# EAGLE design 0529_Agent_KitRev0103 (EAGLE 9.6.2)
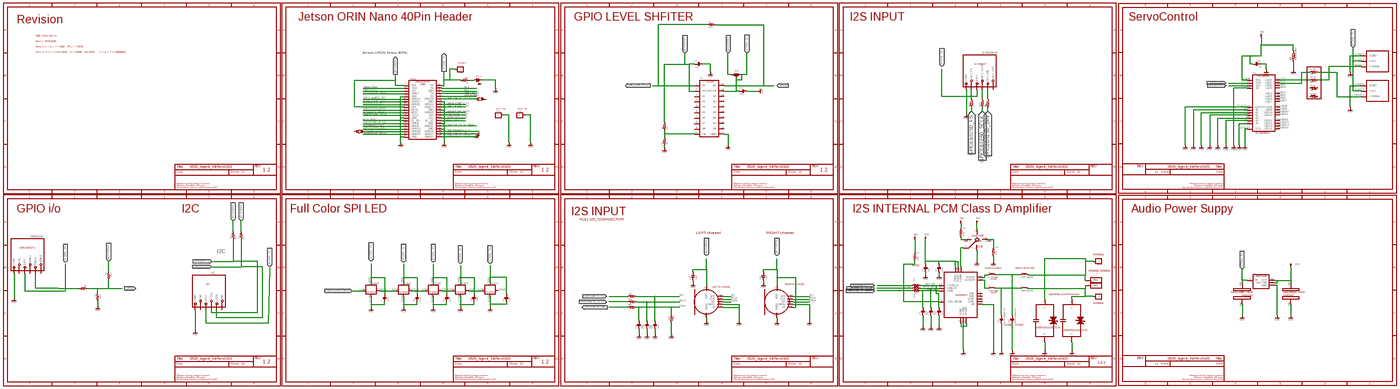
[diagram p0: schematic, sheet 1, overview]
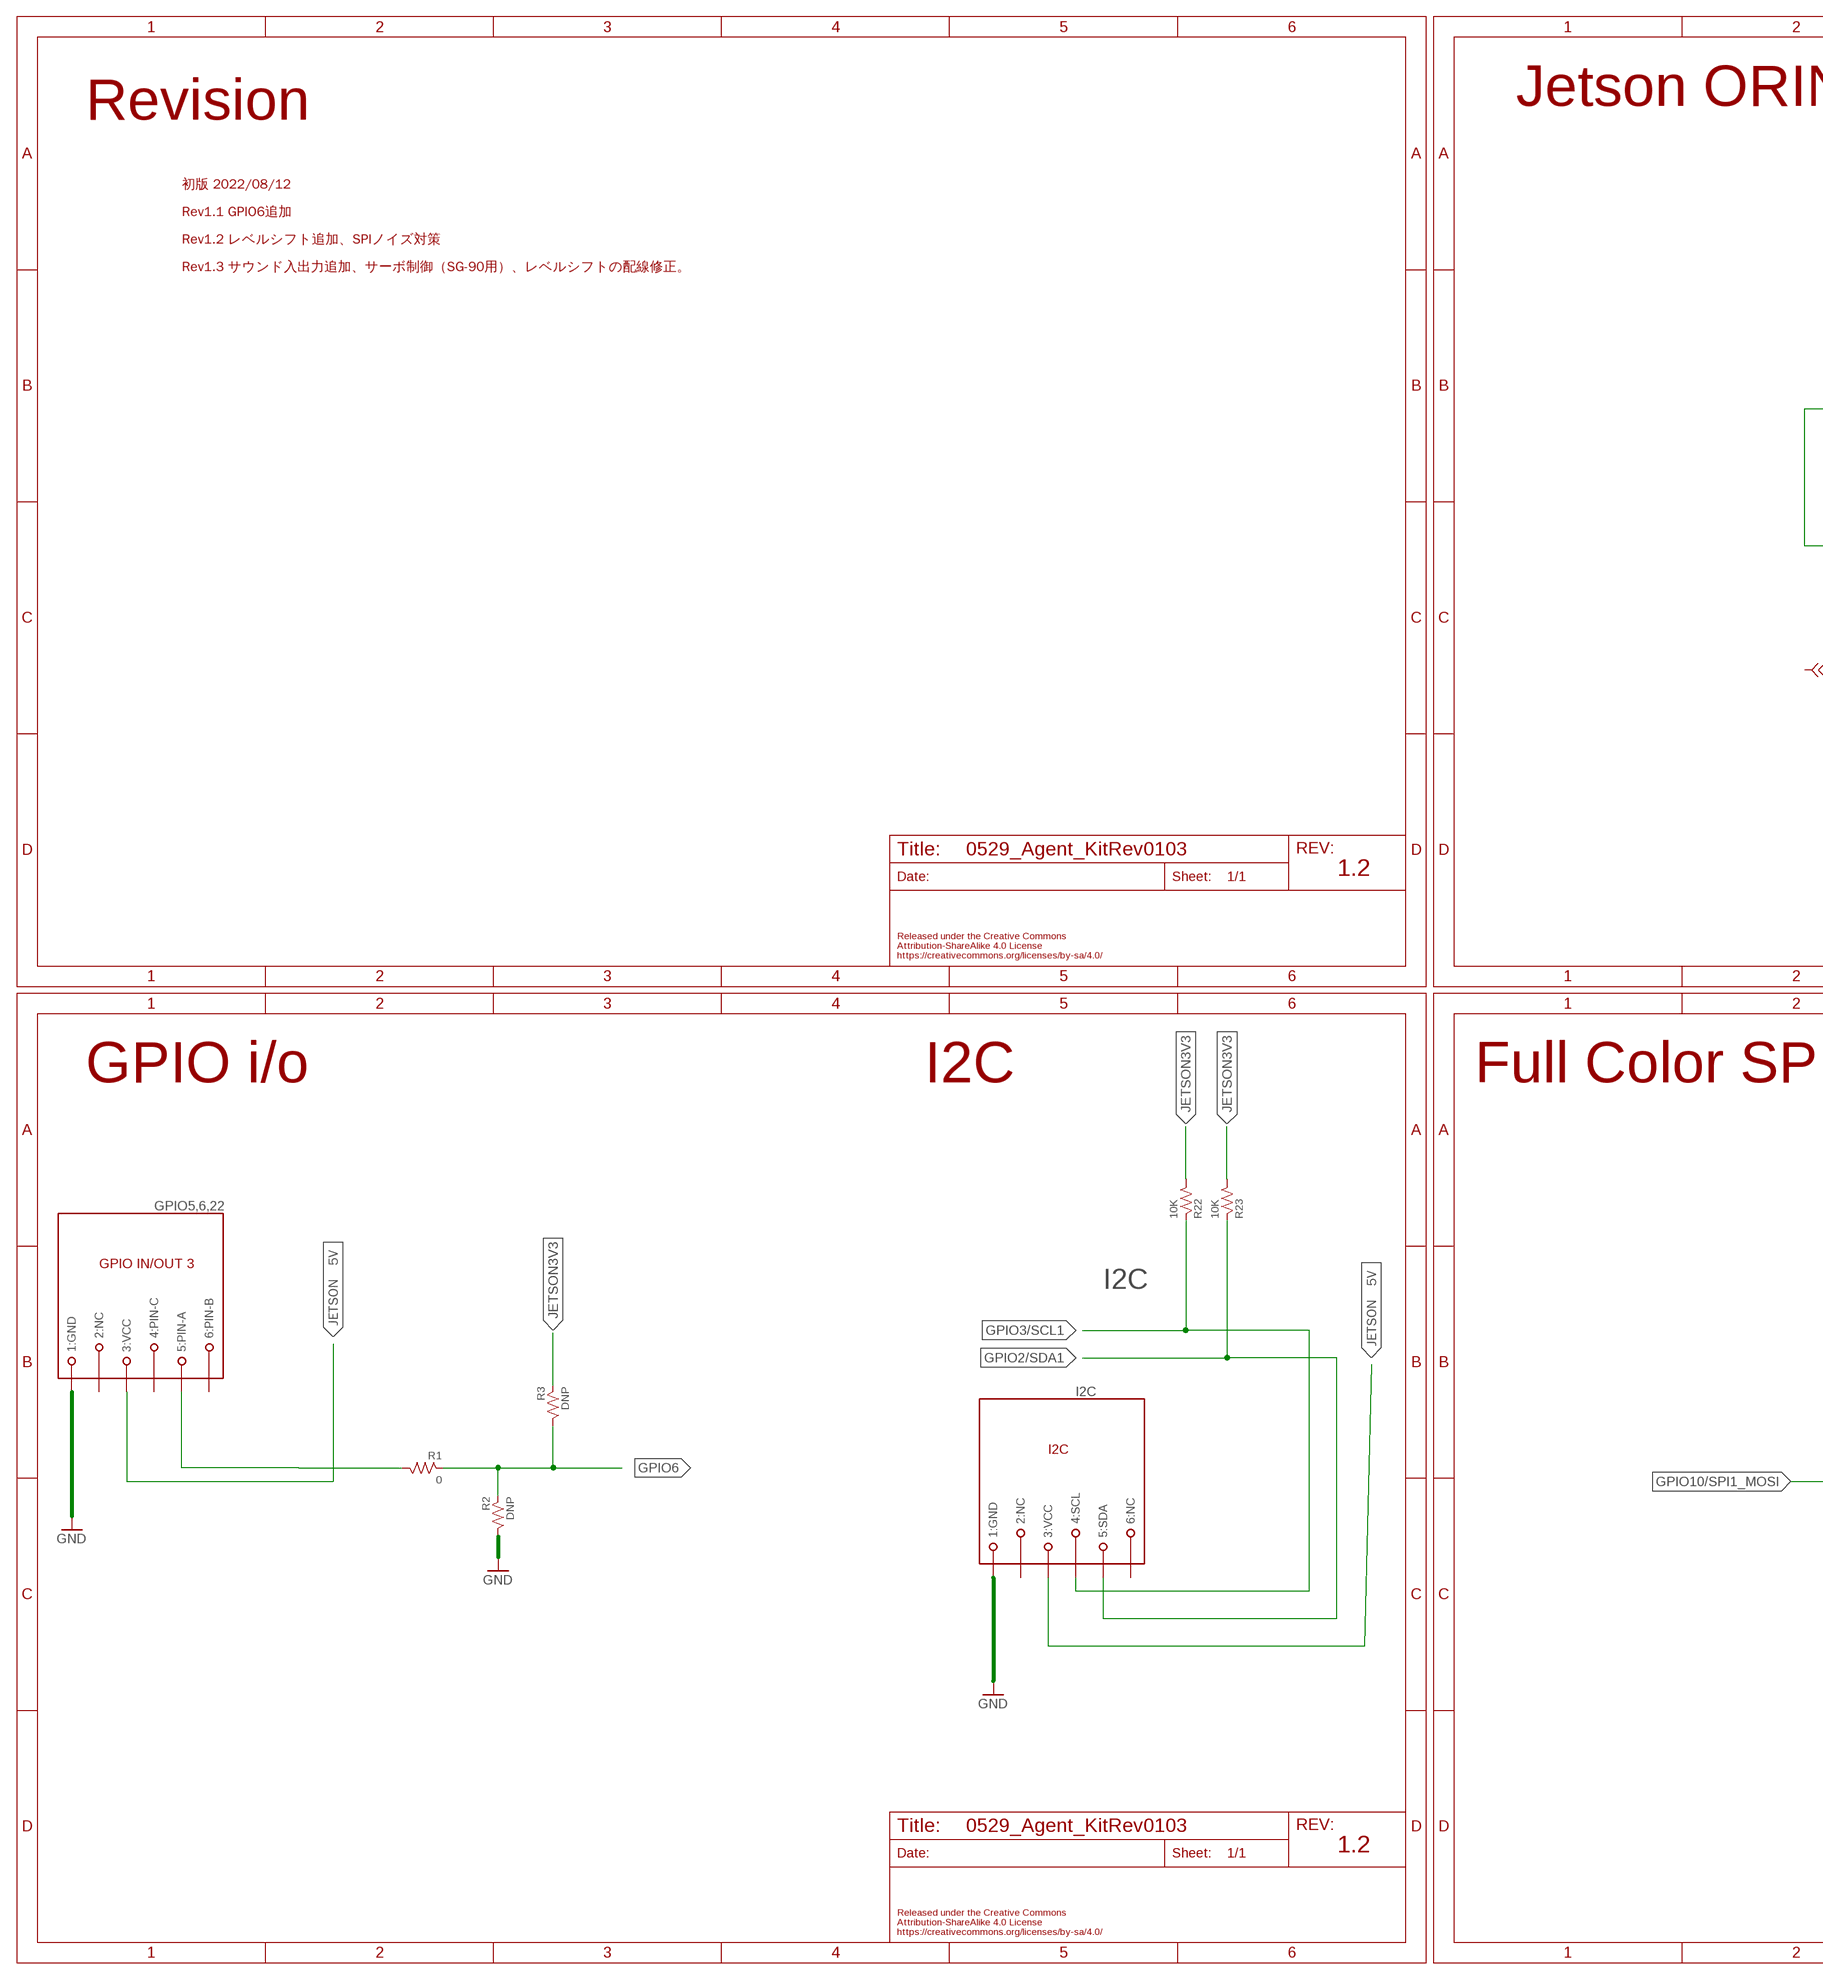
[diagram p1: schematic, sheet 1, part 1 of 4]
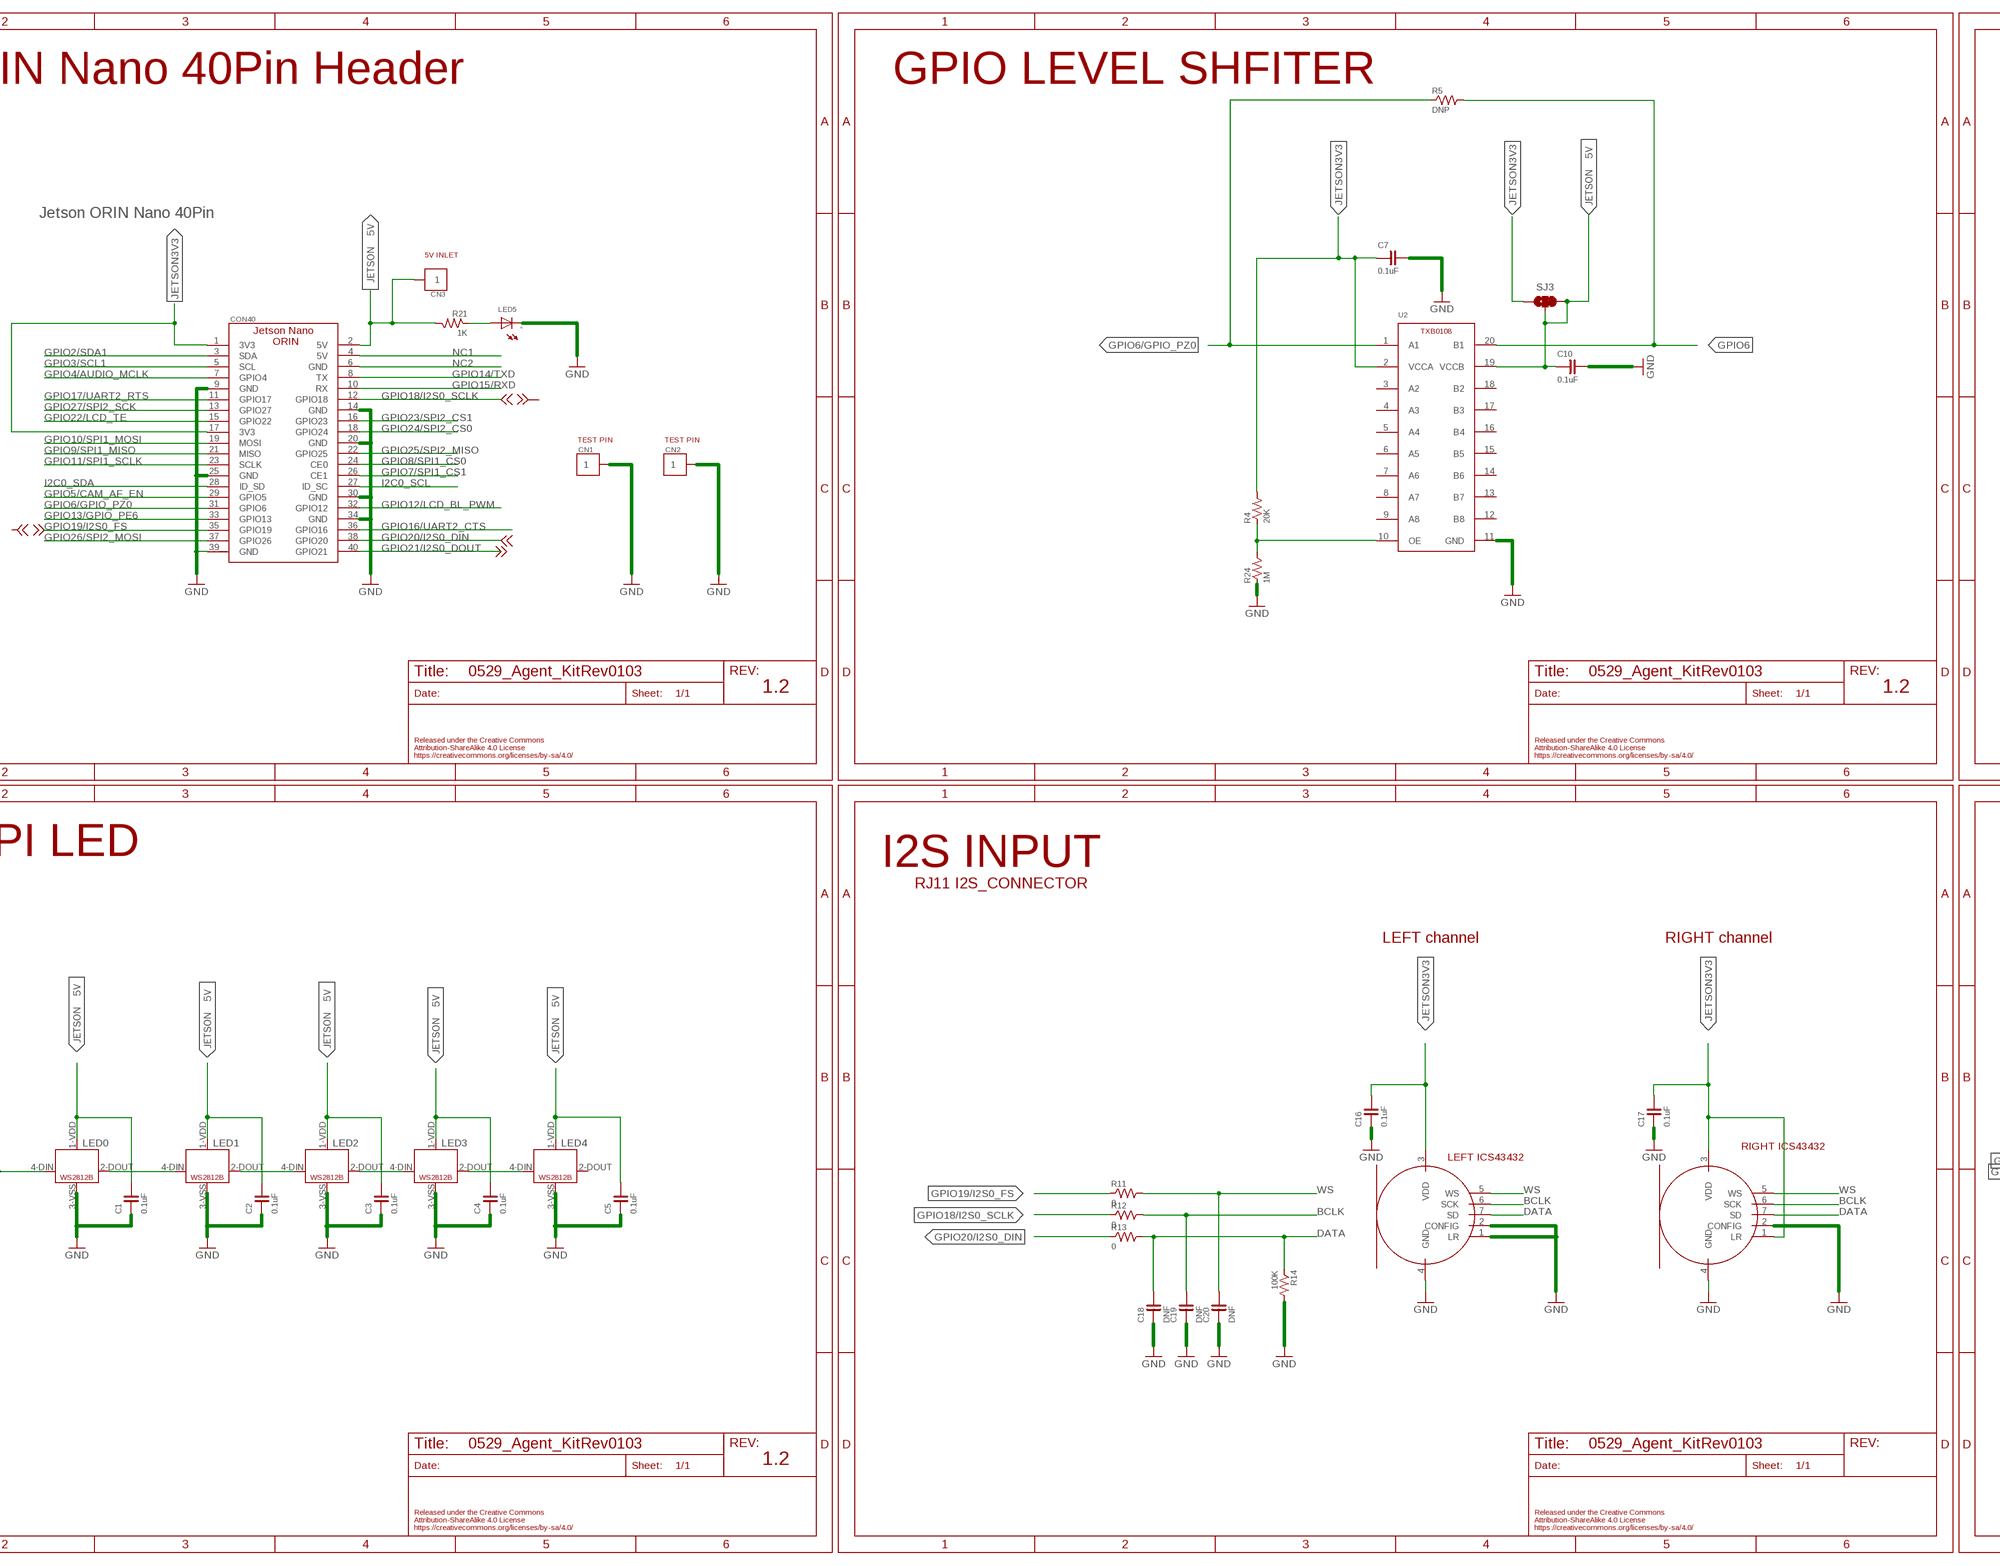
[diagram p2: schematic, sheet 1, part 2 of 4]
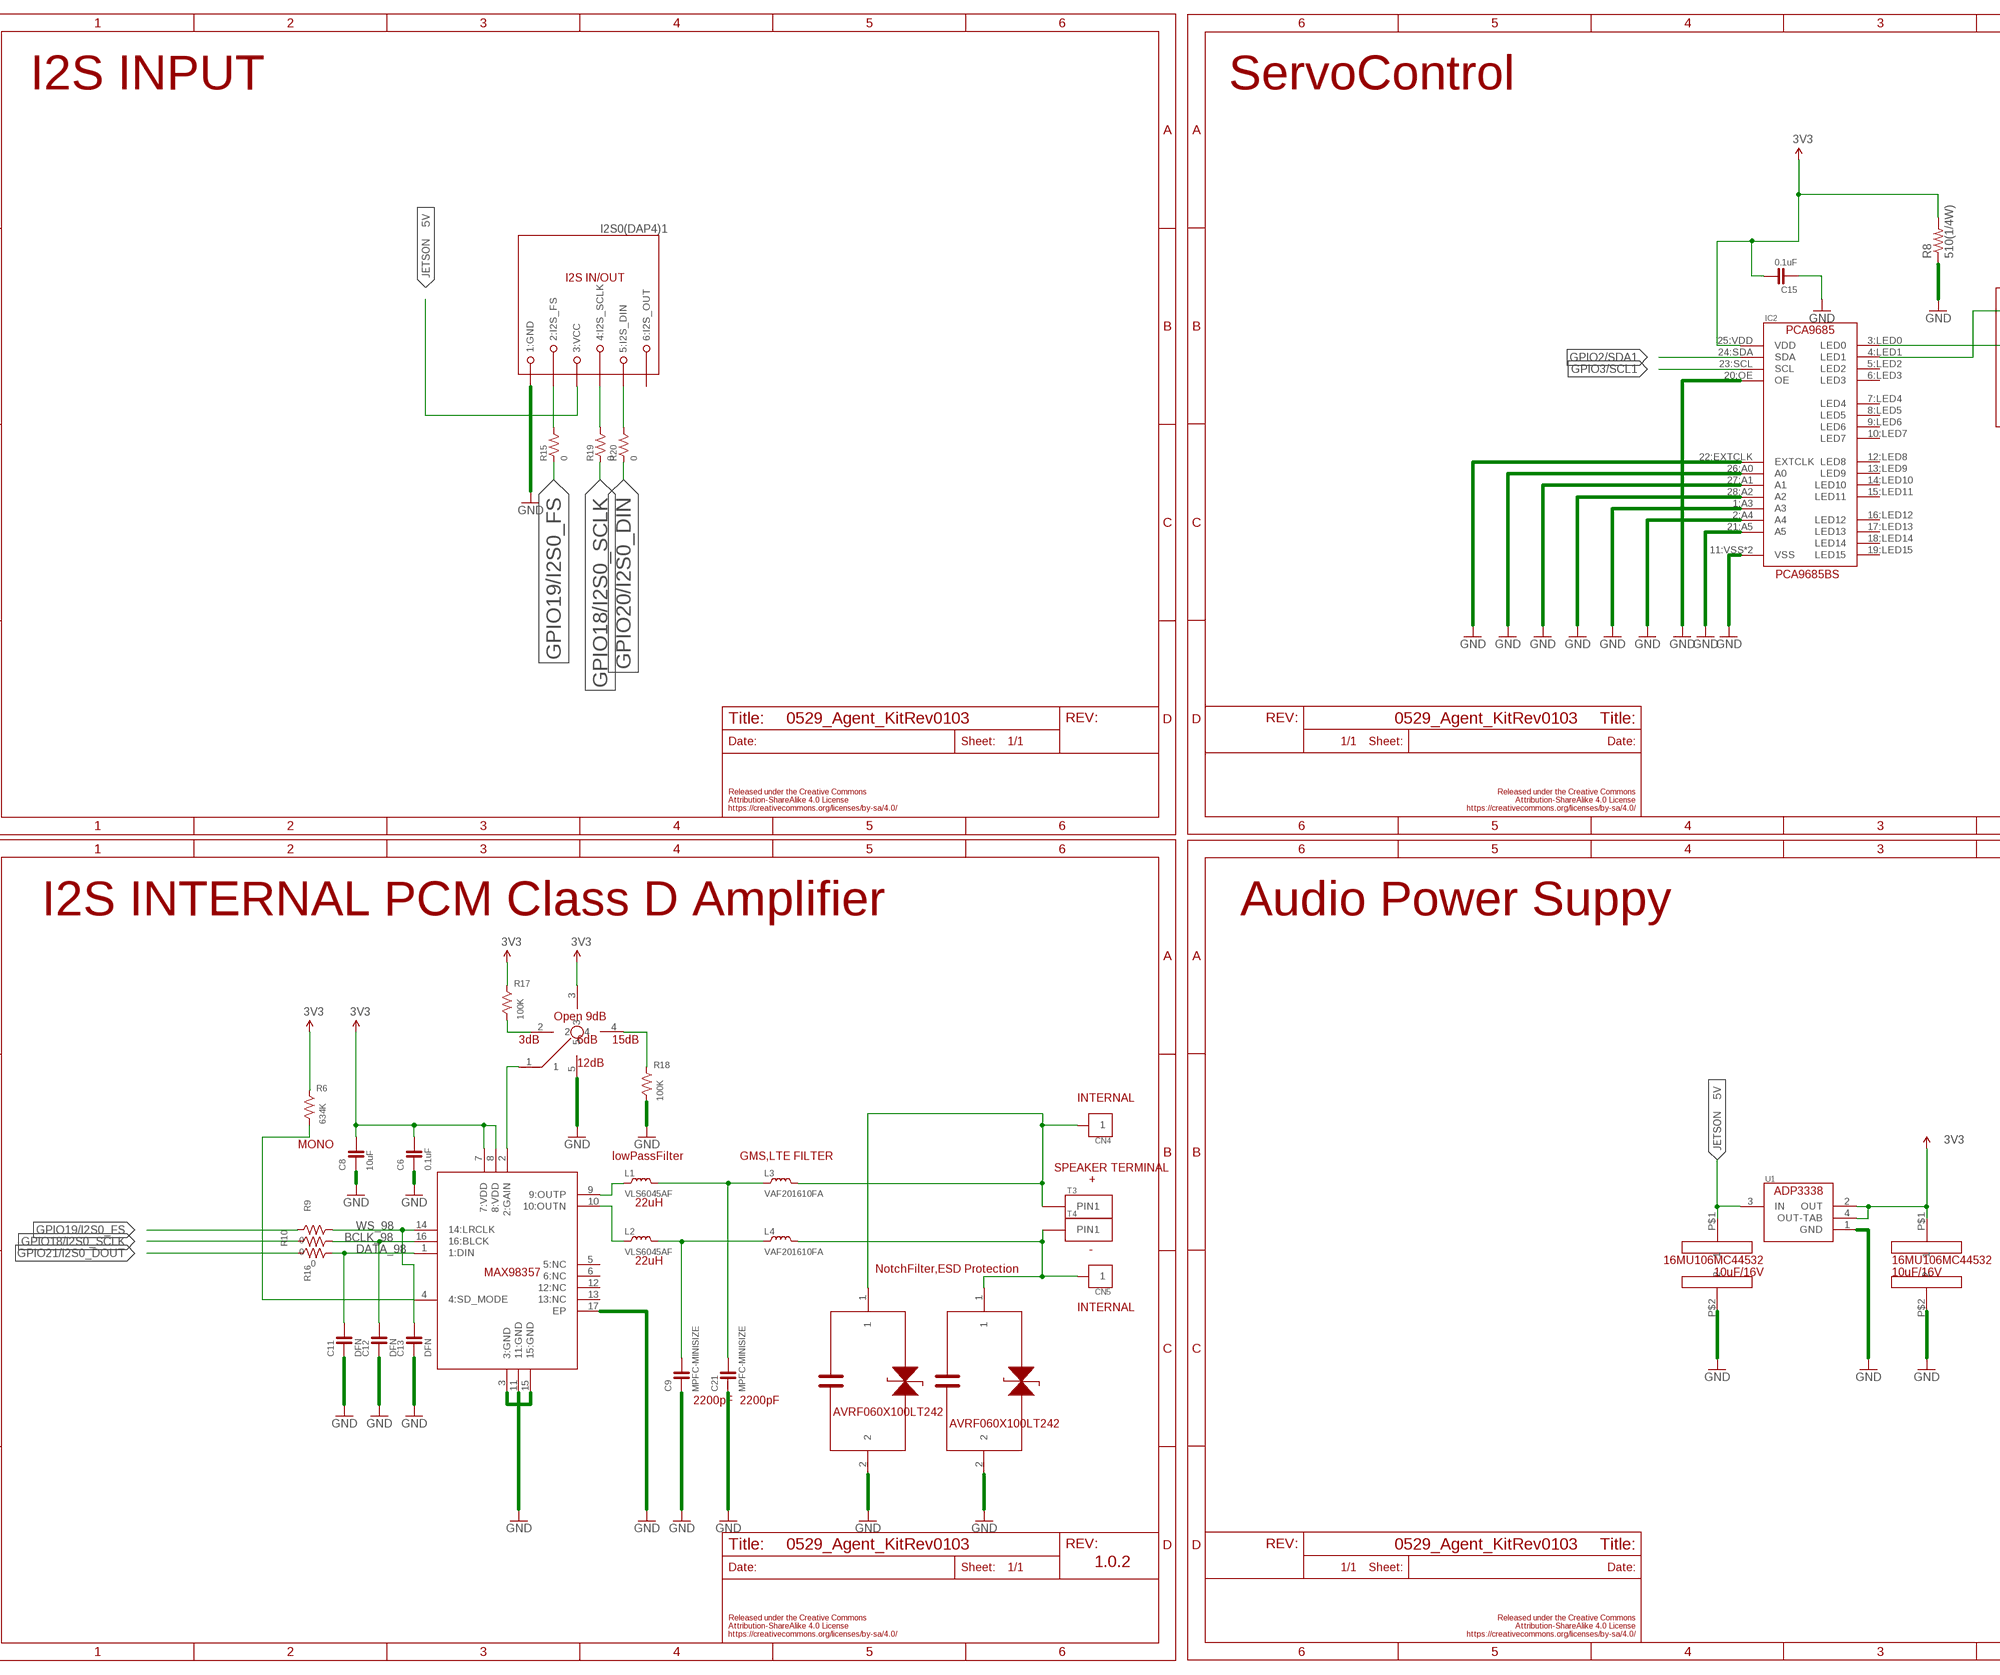
[diagram p3: schematic, sheet 1, part 3 of 4]
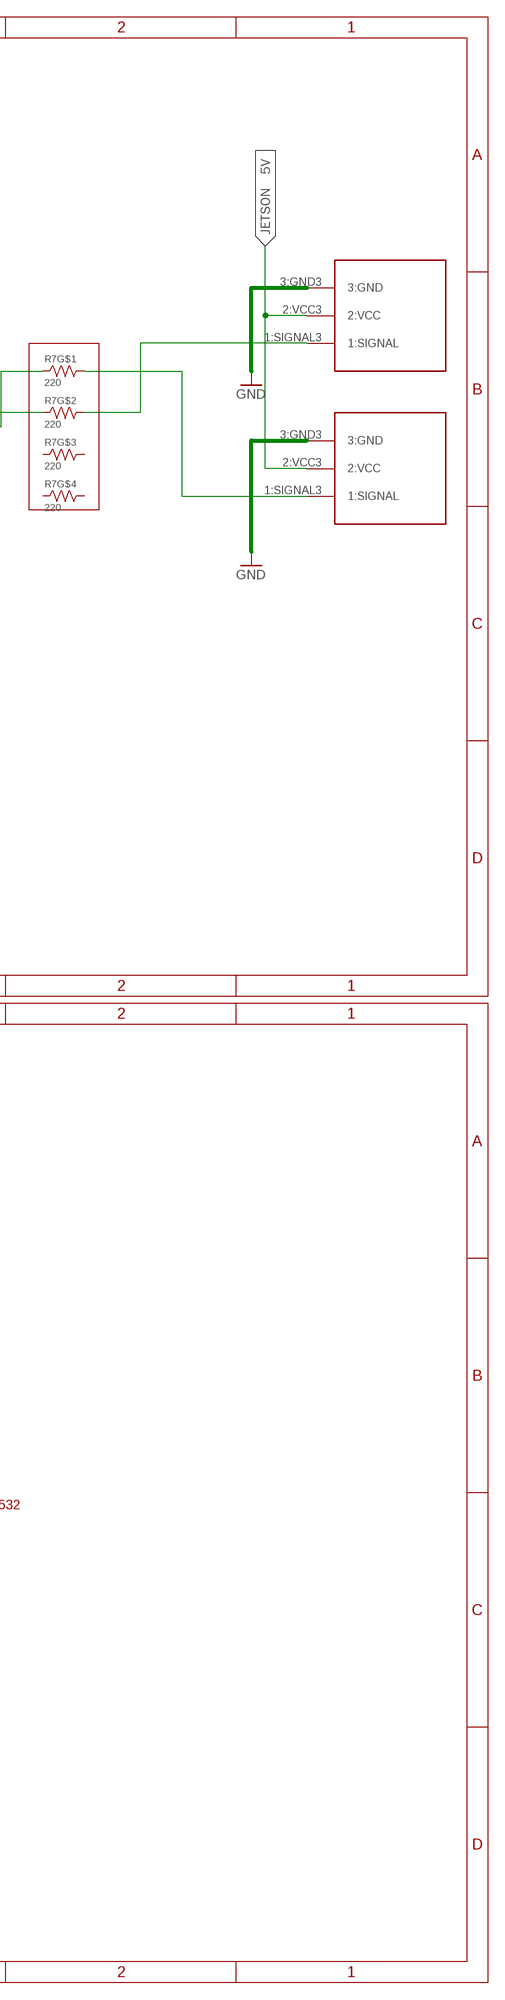
[diagram p4: schematic, sheet 1, part 4 of 4]

## Parts
C1  0.1uF  CAPACITOR-0603_NARROW  [0603-NARROW]
C2  0.1uF  CAPACITOR-0603_NARROW  [0603-NARROW]
C3  0.1uF  CAPACITOR-0603_NARROW  [0603-NARROW]
C4  0.1uF  CAPACITOR-0603_NARROW  [0603-NARROW]
C5  0.1uF  CAPACITOR-0603_NARROW  [0603-NARROW]
C6  0.1uF  CAPACITOR-0603  [0603]
C7  0.1uF  CAPACITOR-0603  [0603]
C8  10uF  CAPACITOR-0603  [0603]
C9  MPFC-MINISIZE  [DIP-MPFC]
C10  0.1uF  CAPACITOR-0603  [0603]
C11  DFN  CAPACITOR-0603  [0603]
C12  DFN  CAPACITOR-0603  [0603]
C13  DFN  CAPACITOR-0603  [0603]
C15  0.1uF  CAPACITOR-0603  [0603]
C16  0.1uF  CAPACITOR-0603  [0603]
C17  0.1uF  CAPACITOR-0603  [0603]
C18  DNF  CAPACITOR-0603  [0603]
C19  DNF  CAPACITOR-0603  [0603]
C20  DNF  CAPACITOR-0603  [0603]
C21  MPFC-MINISIZE  [DIP-MPFC]
C100  POLIYMER_MULTI_LAYER_MU  [4532]
C101  POLIYMER_MULTI_LAYER_MU  [4532]
CN1  PIN_1X1-SMALL  [PIN_1X1_SMALL]
CN2  PIN_1X1-SMALL  [PIN_1X1_SMALL]
CN3  PIN_1X1-SMALL  [PIN_1X1_SMALL]
CN4  PIN_1X1-SMALL  [PIN_1X1_SMALL]
CN5  PIN_1X1-SMALL  [PIN_1X1_SMALL]
CON40  JETSON_NANOJETSON_ORIN_NANO  [JETSON_ORIN_NANO_DIMENTION]
GPIO5,6,22  MODULAR-JACK-6P-RJ11_GPIO3  [7002-6PXC-X]
I2C  MODULAR-JACK-6P-RJ11_I2C  [7002-6PXC-X]
I2S0(DAP4)1  MODULAR-JACK-6P-RJ11_I2S_MASTER  [7002-6PXC-X]
IC2  PCA9685BSPCA9685BS  [HVQFN28]
L1  VLS6045AF  [VLS6045AF]
L2  VLS6045AF  [VLS6045AF]
L3  VAF201610FA  [VAF201610FA-1]
L4  VAF201610FA  [VAF201610FA-1]
LED0  WS2812B_NARROW  [WS2812B_NARROW]
LED1  WS2812B_NARROW  [WS2812B_NARROW]
LED2  WS2812B_NARROW  [WS2812B_NARROW]
LED3  WS2812B_NARROW  [WS2812B_NARROW]
LED4  WS2812B_NARROW  [WS2812B_NARROW]
LED5  LED-0603  [0603]
MIC_LEFT1  TDK-ICS43432  [TDK-ICS43432]
MIC_RIGHT1  TDK-ICS43432  [TDK-ICS43432]
R1  0  RESISTOR-0603  [0603]
R2  DNP  RESISTOR-0603  [0603]
R3  DNP  RESISTOR-0603  [0603]
R4  20K  RESISTOR-0603  [0603]
R5  DNP  RESISTOR-0603  [0603]
R6  634K  RESISTOR-0603  [0603]
R7  220  RESISTOR_ARRAY  [EXBV8V]
R8  510(1/4W)  R-US_R0805  [R0805]
R9  0  RESISTOR-0603  [0603]
R10  0  RESISTOR-0603  [0603]
R11  0  RESISTOR-0603  [0603]
R12  0  RESISTOR-0603  [0603]
R13  0  RESISTOR-0603  [0603]
R14  100K  RESISTOR-0603  [0603]
R15  0  RESISTOR-0402  [0402]
R16  0  RESISTOR-0603  [0603]
R17  100K  RESISTOR-0603  [0603]
R18  100K  RESISTOR-0603  [0603]
R19  0  RESISTOR-0402  [0402]
R20  0  RESISTOR-0402  [0402]
R21  1K  RESISTOR-0603  [0603]
R22  10K  RESISTOR-0603  [0603]
R23  10K  RESISTOR-0603  [0603]
R24  1M  RESISTOR-0603  [0603]
SJ3  SMD-JUMPER-3-23SHORT  [SMD-JUMPER-3]
T3  TBL004-508  [TBL004-508]
T4  TBL004-508  [TBL004-508]
U1  ADP3338AKCZ  [SOT-223-KC3]
U2  TXB0108  [R-PUSON-N20]
U$10  RC_3PIN_SERVO  [PNHEADER_2.54_SMT_3PIN_RC_TT01_02]
U$11  AVRF060X100LT242  [AVRF0X0X100LT_0603]
U$12  AVRF060X100LT242  [AVRF0X0X100LT_0603]
U$13  MAX98357A,B  [TQFN(16L3*3*0.75)]
U$14  2MMJUMPER_CROSS  [PINHEAD2MM_CROSS]
U$16  RC_3PIN_SERVO  [PNHEADER_2.54_SMT_3PIN_RC_TT01_02]

## Nets
3DB: R17.2 U$14.2
3V3: C6.2 C8.2 C15.2 C101.P$1 IC2.25:VDD(VDD) R6.1 R8.2 R17.1 U1.2(OUT) U1.4(OUT-TAB) U$13.7(7:VDD) U$13.8(8:VDD) U$14.3
15DB: R18.1 U$14.4
BCLK: C19.2 MIC_LEFT1.6(SCK) MIC_RIGHT1.6(SCK) R12.2
BCLK_98: C12.2 R10.2 U$13.16(16:BLCK)
DATA: C18.2 MIC_LEFT1.7(SD) MIC_RIGHT1.7(SD) R13.2 R14.1
DATA_98: C11.2 R16.2 U$13.1(1:DIN)
G6: GPIO5,6,22.5(5:PIN-A) R1.2
GAIN: U$13.2(2:GAIN) U$14.1
GND [New Class]: C1.1 C2.1 C3.1 C4.1 C5.1 C6.1 C7.2 C8.1 C9.1 C10.2 C11.1 C12.1 C13.1 C15.1 C16.1 C17.1 C18.1 C19.1 C20.1 C21.1 C100.P$2 C101.P$2 CN1.1 CN2.1 CON40.9(GND) CON40.14(GND) CON40.20(GND) CON40.25(GND) CON40.30(GND) CON40.34(GND) CON40.39(GND) GPIO5,6,22.1(1:GND) I2C.1(1:GND) I2S0(DAP4)1.1(1:GND) IC2.1:A3(A3) IC2.2:A4(A4) IC2.11:VSS(VSS) IC2.20:OE(OE) IC2.21:A5(A5) IC2.22:EXTCLK(EXTCLK) IC2.26:A0(A0) IC2.27:A1(A1) IC2.28:A2(A2) IC2.29(VSS) LED0.3-VSS(VSS) LED1.3-VSS(VSS) LED2.3-VSS(VSS) LED3.3-VSS(VSS) LED4.3-VSS(VSS) LED5.CATHODE MIC_LEFT1.1(LR) MIC_LEFT1.2(CONFIG) MIC_LEFT1.4(GND) MIC_RIGHT1.2(CONFIG) MIC_RIGHT1.4(GND) R2.2 R8.1 R14.2 R18.2 R24.1 U1.1(GND) U2.11(GND) U$10.3:GND3(3:GND) U$11.2 U$12.2 U$13.3(3:GND) U$13.11(11:GND) U$13.15(15:GND) U$13.17(EP) U$14.5 U$16.3:GND3(3:GND)
GPIO2/SDA1 [New Class]: CON40.3(SDA) I2C.5(5:SDA) IC2.24:SDA(SDA) R23.1
GPIO3/SCL1 [New Class]: CON40.5(SCL) I2C.4(4:SCL) IC2.23:SCL(SCL) R22.1
GPIO4/AUDIO_MCLK [New Class]: CON40.7(GPIO4)
GPIO5/CAM_AF_EN [New Class]: CON40.29(GPIO5)
GPIO6: R1.1 R2.1 R3.2 R5.2 U2.20(B1)
GPIO6/GPIO_PZ0 [New Class]: CON40.31(GPIO6) R5.1 U2.1(A1)
GPIO7/SPI1_CS1 [New Class]: CON40.26(CE1)
GPIO8/SPI1_CS0 [New Class]: CON40.24(CE0)
GPIO9/SPI1_MISO [New Class]: CON40.21(MISO)
GPIO10/SPI1_MOSI [New Class]: CON40.19(MOSI) LED0.4-DIN(DIN)
GPIO11/SPI1_SCLK [New Class]: CON40.23(SCLK)
GPIO12/LCD_BL_PWM [New Class]: CON40.32(GPIO12)
GPIO13/GPIO_PE6 [New Class]: CON40.33(GPIO13)
GPIO14/TXD [New Class]: CON40.8(TX)
GPIO15/RXD [New Class]: CON40.10(RX)
GPIO16/UART2_CTS [New Class]: CON40.36(GPIO16)
GPIO17/UART2_RTS [New Class]: CON40.11(GPIO17)
GPIO18/I2S0_SCLK [New Class]: CON40.12(GPIO18) R10.1 R12.1 R19.1
GPIO19/I2S0_FS [New Class]: CON40.35(GPIO19) R9.1 R11.1 R15.1
GPIO20/I2S0_DIN [New Class]: CON40.38(GPIO20) R13.1 R20.1
GPIO21/I2S0_DOUT [New Class]: CON40.40(GPIO21) R16.1
GPIO22/LCD_TE [New Class]: CON40.15(GPIO22)
GPIO23/SPI2_CS1 [New Class]: CON40.16(GPIO23)
GPIO24/SPI2_CS0 [New Class]: CON40.18(GPIO24)
GPIO25/SPI2_MISO [New Class]: CON40.22(GPIO25)
GPIO26/SPI2_MOSI [New Class]: CON40.37(GPIO26)
GPIO27/SPI2_SCK [New Class]: CON40.13(GPIO27)
I2C0_SCL [New Class]: CON40.27(ID_SC)
I2C0_SDA [New Class]: CON40.28(ID_SD)
JETSON3V3 [New Class]: C7.1 C16.2 C17.2 CON40.1(3V3) CON40.17(3V3) MIC_LEFT1.3(VDD) MIC_RIGHT1.1(LR) MIC_RIGHT1.3(VDD) R3.1 R4.2 R22.2 R23.2 SJ3.1 U2.2(VCCA)
JETSON　5V [New Class]: C1.2 C2.2 C3.2 C4.2 C5.2 C10.1 C100.P$1 CN3.1 CON40.2(5V) GPIO5,6,22.3(3:VCC) I2C.3(3:VCC) I2S0(DAP4)1.3(3:VCC) LED0.1-VDD(VDD) LED1.1-VDD(VDD) LED2.1-VDD(VDD) LED3.1-VDD(VDD) LED4.1-VDD(VDD) R21.2 SJ3.2 SJ3.3 U1.3(IN) U2.19(VCCB) U$10.2:VCC3(2:VCC) U$16.2:VCC3(2:VCC)
MONO: R6.2 U$13.4(4:SD_MODE)
N$1: LED0.2-DOUT(DOUT) LED1.4-DIN(DIN)
N$2: I2S0(DAP4)1.2(2:I2S_FS) R15.2
N$3: I2S0(DAP4)1.4(4:I2S_SCLK) R19.2
N$4: I2S0(DAP4)1.5(5:I2S_DIN) R20.2
N$5: LED5.ANODE R21.1
N$6: LED1.2-DOUT(DOUT) LED2.4-DIN(DIN)
N$7: IC2.4:LED1(LED1) R7.1
N$8: LED2.2-DOUT(DOUT) LED3.4-DIN(DIN)
N$9: LED3.2-DOUT(DOUT) LED4.4-DIN(DIN)
N$10: IC2.3:LED0(LED0) R7.2
N$12: R7.7 U$10.1:SIGNAL3(1:SIGNAL)
N$13: R7.8 U$16.1:SIGNAL3(1:SIGNAL)
N$28: R4.1 R24.2 U2.10(OE)
NC1 [New Class]: CON40.4(5V)
NC2 [New Class]: CON40.6(GND)
OUTN: L2.1 U$13.10(10:OUTN)
OUTP: L1.1 U$13.9(9:OUTP)
SP_M: C9.2 L2.2 L4.1
SP_MINUS: CN5.1 L4.2 T4.P$1(PIN1) T4.P$2(PIN1) U$12.1
SP_P: C21.2 L1.2 L3.1
SP_PLUS: CN4.1 L3.2 T3.P$1(PIN1) T3.P$2(PIN1) U$11.1
WS: C20.2 MIC_LEFT1.5(WS) MIC_RIGHT1.5(WS) R11.2
WS_98: C13.2 R9.2 U$13.14(14:LRCLK)
Unconnected: GPIO5,6,22.2(2:NC) GPIO5,6,22.4(4:PIN-C) GPIO5,6,22.6(6:PIN-B) I2C.2(2:NC) I2C.6(6:NC) I2S0(DAP4)1.6(6:I2S_OUT) IC2.5:LED2(LED2) IC2.6:LED3(LED3) IC2.7:LED4(LED4) IC2.8:LED5(LED5) IC2.9:LED6(LED6) IC2.10:LED7(LED7) IC2.12:LED8(LED8) IC2.13:LED9(LED9) IC2.14:LED10(LED10) IC2.15:LED11(LED11) IC2.16:LED12(LED12) IC2.17:LED13(LED13) IC2.18:LED14(LED14) IC2.19:LED15(LED15) LED4.2-DOUT(DOUT) R7.3 R7.4 R7.5 R7.6 U2.3(A2) U2.4(A3) U2.5(A4) U2.6(A5) U2.7(A6) U2.8(A7) U2.9(A8) U2.12(B8) U2.13(B7) U2.14(B6) U2.15(B5) U2.16(B4) U2.17(B3) U2.18(B2) U$13.5(5:NC) U$13.6(6:NC) U$13.12(12:NC) U$13.13(13:NC)

## Notes on the sheet
- Revision | Jetson ORIN Nano 40Pin Header | GPIO LEVEL SHFITER | I2S INPUT | ServoControl
- 初版 2022/08/12
- Rev1.1 GPIO6追加
- Rev1.2 レベルシフト追加、SPIノイズ対策
- Rev1.3 サウンド入出力追加、サーボ制御（SG-90用）、レベルシフトの配線修正。
- Jetson ORIN Nano 40Pin
- 5V INLET
- ORIN
- TEST PIN | TEST PIN
- PCA9685BS
- 1.2 | 1.2 | 1.2
- GPIO i/o | I2C | Full Color SPI LED | I2S INPUT | I2S INTERNAL PCM Class D Amplifier | Audio Power Suppy
- RJ11 I2S_CONNECTOR
- LEFT channel | RIGHT channel
- Open 9dB
- 3dB | 6dB | 15dB
- 12dB
- I2C
- INTERNAL
- MONO
- lowPassFilter | GMS,LTE FILTER
- SPEAKER TERMINAL
- +
- 22uH
- RIGHT ICS43432
- LEFT ICS43432
- -
- 22uH | NotchFilter,ESD Protection
- 16MU106MC44532
  10uF/16V
- 16MU106MC44532
  10uF/16V
- INTERNAL
- 2200pF | 2200pF
- AVRF060X100LT242
- AVRF060X100LT242
- 1.2 | 1.2 | 1.0.2

## Library data of the parts
C1-C8 C10-C13 C15-C20 = FaBo-Capacitor:CAPACITOR: CAPACITOR
C9 C21 = FaBo-Capacitor:MPFC-MINISIZE
C100 C101 = FaBo-Capacitor:POLIYMER_MULTI_LAYER_MU: Rubycon 16MU106MC44532 10uF/16V +-20% size 4532
CN1-CN5 = FaBo-PIN:PIN_1X1
CON40 = FaBo-Boards:JETSON_NANO
GPIO5,6,22 = FaBo-Connetor:MODULAR-JACK-6P-RJ11_GPIO3
I2C = FaBo-Connetor:MODULAR-JACK-6P-RJ11_I2C
I2S0(DAP4)1 = FaBo-Connetor:MODULAR-JACK-6P-RJ11_I2S_MASTER
IC2 = FaBo-Motor:PCA9685BS
L1 L2 = FaBo-Coil:VLS6045AF
L3 L4 = FaBo-Coil:VAF201610FA
LED0 LED1-LED4 = FaBo-LED:WS2812B_NARROW
LED5 = FaBo-LED:LED
MIC_LEFT1 MIC_RIGHT1 = FaBo-Mems:TDK-ICS43432
R1-R6 R9-R24 = FaBo-Resistors:RESISTOR: RESISTOR
R7 = component:RESISTOR_ARRAY
R8 = rcl:R-US_: RESISTOR, American symbol; SPICEPREFIX: R
SJ3 = FaBo-etc:SMD-JUMPER-3-23SHORT
T3 T4 = FaBo-Terminal:TBL004-508
U1 = FaBo-Supply:ADP3338AKCZ
U2 = FaBo-LevelTranslator:TXB0108
U$10 U$16 = FaBo-PIN:RC_3PIN_SERVO
U$11 U$12 = FaBo-Coil:AVRF060X100LT242: ESD Notch Filters For wireless audio equipment TDK AVRF series ESD protection and noise protechtion.
U$13 = FaBo-AudioIC:MAX98357A,B
U$14 = FaBo-PIN:2MMJUMPER_CROSS

## Board
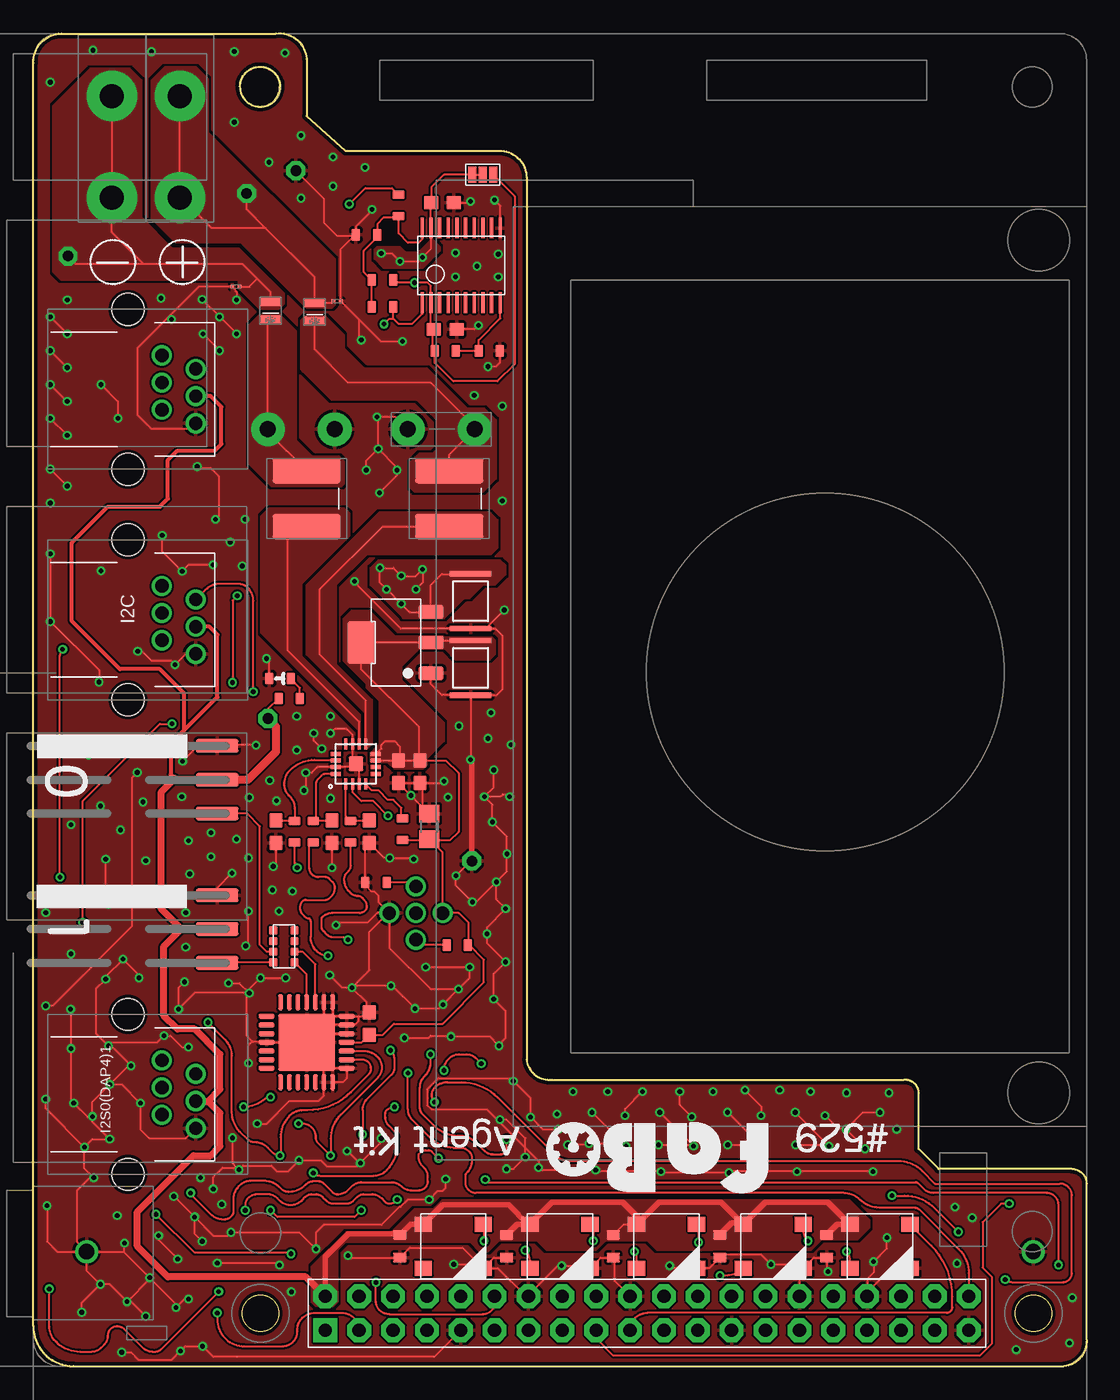
[diagram p5: board, top side]
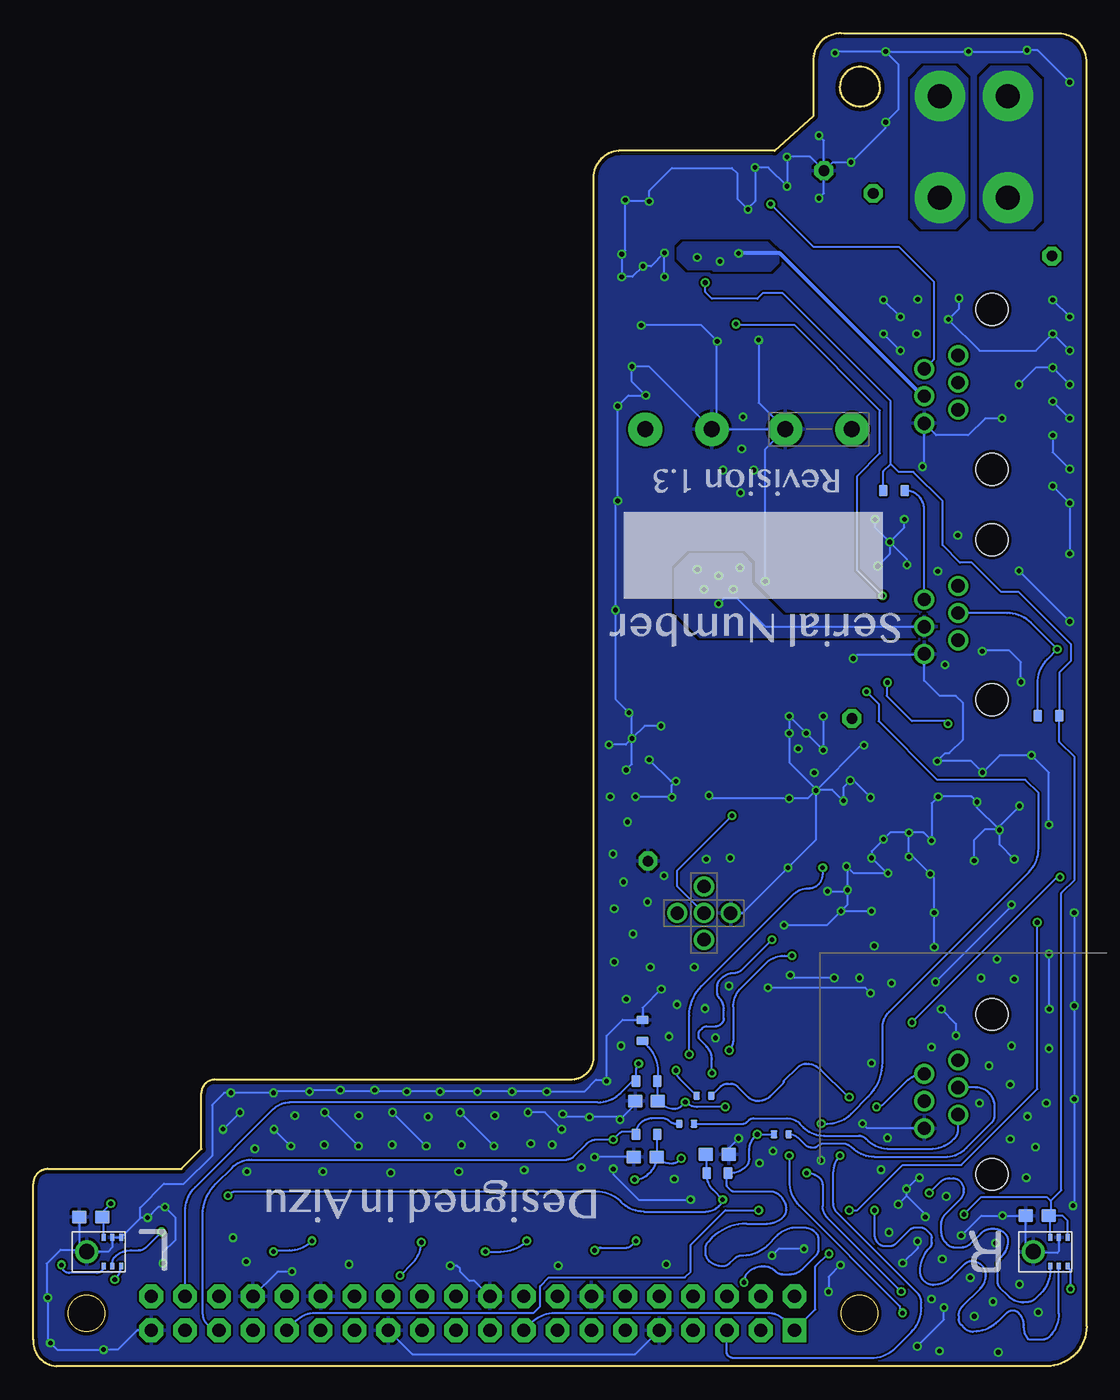
[diagram p6: board, bottom side, seen from below]

Size 79.01 x 100.01 mm. Coordinates in mm from the lower left corner, seen from the top.
Outline: 38.9,21.5 65.3,21.5 arc-96 66.4,20.5 66.4,16.3 67.9,14.8 77.9,14.8 arc-90 79,13.7 79,2 arc-90 77.3,0 3,0 arc-90 0,3 0,97.8 arc-90 2.1,100 18.2,100 arc-93 20.5,98.1 20.5,93.8 23.4,91.2 35.1,91.2 arc-90 37,89 37,23 arc90 38.9,21.5
Outline: 15.5,96 arc-180 18.5,96 arc-180 15.5,96
Copper layers (1*16): Top 0.035mm / dielectric 1.6mm / Bottom 0.035mm
Design rules "PCBway": minimum track width 6mil, minimum drill 12mil, track to track 6mil, track to pad 6mil, pad to pad 6mil, via to via 6mil, smd to smd 6mil, copper to edge 10mil, drill to drill 10mil, minimum pad ring 10mil, minimum via ring 6mil, stop-mask expansion 2mil, vias tented up to drill 100mil, thermal gap 8mil
tKeepout: area 0.2,85.7 to 3.2,100.3
bKeepout: area -0.5,52.7 to 6.5,62.7; area -0.6,35.1 to 6.4,45.1

### Footprints (pad centres in the part's own frame; a part is rotated, then mirrored left to right if it is on the bottom)
0603-NARROW = smd 0.71 x 1: 1 -0.85,0; 2 0.85,0
0603 = smd 1.1 x 1: 1 -0.85,0; 2 0.85,0
DIP-MPFC = drill 1.2 pad 2.54: 1 -2.5,0; 2 2.5,0
4532 = smd 0.4 x 3.2: P$1 2.05,0; P$2 -2.05,0
PIN_1X1_SMALL = drill 0.8 pad 1.422 octagon: 1 0,0
JETSON_ORIN_NANO_DIMENTION = drill 1 pad 1.778 square: 1 21.9,2.7 | drill 1 pad 1.778 octagon: 2 21.9,5.24; 3 24.44,2.7; 4 24.44,5.24; 5 26.98,2.7; 6 26.98,5.24; 7 29.52,2.7; 8 29.52,5.24; 9 32.06,2.7; 10 32.06,5.24; 11 34.6,2.7; 12 34.6,5.24; 13 37.14,2.7; 14 37.14,5.24; 15 39.68,2.7; 16 39.68,5.24; 17 42.22,2.7; 18 42.22,5.24; 19 44.76,2.7; 20 44.76,5.24; 21 47.3,2.7; 22 47.3,5.24; 23 49.84,2.7; 24 49.84,5.24; 25 52.38,2.7; 26 52.38,5.24; 27 54.92,2.7; 28 54.92,5.24; 29 57.46,2.7; 30 57.46,5.24; 31 60,2.7; 32 60,5.24; 33 62.54,2.7; 34 62.54,5.24; 35 65.08,2.7; 36 65.08,5.24; 37 67.62,2.7; 38 67.62,5.24; 39 70.16,2.7; 40 70.16,5.24
7002-6PXC-X = drill 1: 1 2.55,5.08; 2 1.53,2.54; 3 0.51,5.08; 4 -0.51,2.54; 5 -1.53,5.08; 6 -2.55,2.54 | hole 2.4: -6,0; 6,0
HVQFN28 = smd 1.2 x 0.38: 1:A3 -3,1.95; 2:A4 -3,1.3; 3:LED0 -3,0.65; 4:LED1 -3,0; 5:LED2 -3,-0.65; 6:LED3 -3,-1.3; 7:LED4 -3,-1.95; 15:LED11 3,-1.95; 16:LED12 3,-1.3; 17:LED13 3,-0.65; 18:LED14 3,0; 19:LED15 3,0.65; 20:OE 3,1.3; 21:A5 3,1.95 | smd 0.38 x 1.2: 8:LED5 -1.95,-3; 9:LED6 -1.3,-3; 10:LED7 -0.65,-3; 11:VSS 0,-3; 12:LED8 0.65,-3; 13:LED9 1.3,-3; 14:LED10 1.95,-3; 22:EXTCLK 1.95,3; 23:SCL 1.3,3; 24:SDA 0.65,3; 25:VDD 0,3; 26:A0 -0.65,3; 27:A1 -1.3,3; 28:A2 -1.95,3 | smd 4.25 x 4.25: 29 0,0
VLS6045AF = smd 1.9 x 5.1: 1 -2.1,0; 2 2.1,0
VAF201610FA-1 = smd 0.65 x 1.6: 1 -0.675,0; 2 0.675,0
WS2812B_NARROW = smd 1.3 x 1.1: 1-VDD -2.25,1.65; 2-DOUT -2.25,-1.65; 3-VSS 2.25,-1.65; 4-DIN 2.25,1.65
0603' = smd 0.65 x 0.9: ANODE -0.8,0; CATHODE 0.8,0
TDK-ICS43432 = smd 0.5 x 0.3: 1 1.075,-2.575; 2 1.075,-1.925; 3 1.075,-1.275; 5 -1.075,-1.275; 6 -1.075,-1.925; 7 -1.075,-2.575 | drill 1.15 pad 1.65: 4 0,0
0603'' = smd 0.65 x 0.9: 1 -0.8,0; 2 0.8,0
EXBV8V = smd 0.6 x 0.6: 1 -1.2,-0.8; 2 -0.4,-0.8; 3 0.4,-0.8; 4 1.2,-0.8; 5 1.2,0.8; 6 0.4,0.8; 7 -0.4,0.8; 8 -1.2,0.8
R0805 = smd 1.3 x 1.5: 1 -0.95,0; 2 0.95,0
0402 = smd 0.5 x 0.6: 1 -0.55,0; 2 0.55,0
SMD-JUMPER-3 = smd 0.61 x 1.219: 1 -0.787,0; 2 0,0; 3 0.787,0
TBL004-508 = drill 1.8 pad 3.81: P$1 0,3.81; P$2 0,-3.81
SOT-223-KC3 = smd 1 x 1.9: 1 -2.3,-2.625; 2 0,-2.625; 3 2.3,-2.625 | smd 3.15 x 2: 4 0,2.625
R-PUSON-N20 = smd 0.25 x 1.55: 1 -2.925,-2.8; 2 -2.275,-2.8; 3 -1.625,-2.8; 4 -0.975,-2.8; 5 -0.325,-2.8; 6 0.325,-2.8; 7 0.975,-2.8; 8 1.625,-2.8; 9 2.275,-2.8; 10 2.925,-2.8; 11 2.925,2.8; 12 2.275,2.8; 13 1.625,2.8; 14 0.975,2.8; 15 0.325,2.8; 16 -0.325,2.8; 17 -0.975,2.8; 18 -1.625,2.8; 19 -2.275,2.8; 20 -2.925,2.8
PNHEADER_2.54_SMT_3PIN_RC_TT01_02 = smd 1.02 x 3.17: 1:SIGNAL3 -2.54,0; 2:VCC3 0,0; 3:GND3 2.54,0
AVRF0X0X100LT_0603 = smd 0.25 x 0.3: 1 -0.275,0; 2 0.275,0
TQFN(16L3*3*0.75) = smd 0.28 x 0.8: 1 -0.75,-1.5; 2 -0.25,-1.5; 3 0.25,-1.5; 4 0.75,-1.5; 9 0.75,1.5; 10 0.25,1.5; 11 -0.25,1.5; 12 -0.75,1.5 | smd 0.8 x 0.28: 5 1.5,-0.75; 6 1.5,-0.25; 7 1.5,0.25; 8 1.5,0.75; 13 -1.5,0.75; 14 -1.5,0.25; 15 -1.5,-0.25; 16 -1.5,-0.75 | smd 1.1 x 1.1: 17 0,0
PINHEAD2MM_CROSS = drill 1: 1 0,0; 2 -2,0; 3 0,2; 4 2,0; 5 0,-2

### Placement (x,y rotation side)
C1  35.5,9 90 top
C2  43.5,9 90 top
C3  51.5,9 90 top
C4  59.5,9 90 top
C5  27.5,9 90 top
C6  27.4,44.6 90 top
C7  30.9,77.8 0 top
C8  29,44.6 90 top
C9  20.1,70.3 0 bottom
C10  30.7,87.3 0 top
C11  25.2,40.1 90 top
C12  22.4,40.1 90 top
C13  18.2,40.1 90 top
C15  25.2,25.7 270 top
C16  3.7,11.3 0 bottom
C17  74.7,11.2 0 bottom
C18  33,19.9 0 bottom
C19  27.7,15.9 180 bottom
C20  33.1,15.7 0 bottom
C21  30.6,70.3 0 top
C100  32.8,57.4 90 top
C101  32.8,52.4 90 top
CN1  19.7,89.7 0 top
CN2  32.9,37.9 0 top
CN3  17.6,48.6 0 top
CN4  16,88 0 top
CN5  2.6,83.3 0 top
CON40  0,0 0 top
GPIO5,6,22  7.1,73.3 270 top
I2C  7.1,56 270 top
I2S0(DAP4)1  7.1,20.4 270 top
IC2  20.5,24.3 270 top
L1  31.2,65.1 90 top
L2  20.5,65.1 90 top
L3  21.1,79.1 90 top
L4  17.8,79.2 90 top
LED0  63.5,9 0 top
LED1  55.5,9 0 top
LED2  47.5,9 0 top
LED3  39.5,9 0 top
LED4  31.5,9 0 top
LED5  [0603']  18.5,51.6 180 top
MIC_LEFT1  75,8.6 90 bottom
MIC_RIGHT1  4,8.6 90 bottom
R1  0  [0603'']  27.4,87.1 90 top
R2  DNP  [0603'']  25,84.9 180 top
R3  DNP  [0603'']  26.2,81.5 180 top
R4  20K  [0603'']  30.9,76.2 180 top
R5  DNP  [0603'']  26.2,79.5 180 top
R6  634K  [0603'']  27.7,40.3 90 top
R7  18.8,31.5 90 top
R8  29.7,40.5 270 top
R9  0  [0603'']  19.6,40.1 90 top
R10  0  [0603'']  21,40.1 90 top
R11  0  [0603'']  33,17.4 0 bottom
R12  0  [0603'']  27.7,14.5 180 bottom
R13  0  [0603'']  33,21.4 0 bottom
R14  100K  [0603'']  33.3,25.2 90 bottom
R15  30,18.2 0 bottom
R16  0  [0603'']  23.8,40.1 90 top
R17  100K  [0603'']  31.8,31.6 180 top
R18  100K  [0603'']  25.7,36.3 180 top
R19  22.9,17.4 0 bottom
R20  28.7,20.3 0 bottom
R21  1K  [0603'']  19.2,50.1 180 top
R22  10K  [0603'']  2.85,48.8 0 bottom
R23  10K  [0603'']  14.45,65.7 180 bottom
R24  1M  [0603'']  34.2,76.2 180 top
SJ3  33.7,89.4 180 top
T3  11,91.5 180 top
T4  5.9,91.5 180 top
U1  27.2,54.3 90 top
U2  32.1,82.6 0 top
U$10  13.8,44 90 top
U$11  22.8,79.9 0 top
U$12  15.2,81 180 top
U$13  24.2,45.2 0 top
U$14  28.7,34 90 bottom
U$16  13.8,32.8 90 top
U$17  [LOGO_FABO_L]  47.5,18.3 180 top

### Tracks (layer width: path | path; a pad name or v marks a point on that pad's centre or on a via)
3DB
  Top 0.152: R17.2 29.1,31.6 U$14.2
3V3
  Top 0.152: C101.P$1 29.98,54.45 U1.2 U1.4 24.57,52.33 28.9,48 28.9,45.45 | U$13.7 C6.2 | C6.2 28.9,45.45 | 28.9,45.45 C8.2 30.95,45.45 31.9,44.5 31.9,40.1 31.25,39.45 29.9,39.45 | IC2.25:VDD 24.65,24.3 C15.2 26.2,24.85 27.05,25.7 30.7,25.7 33.8,28.8 33.8,30.5 32.7,31.6 R17.1 32.65,31.65 32.65,33.25 31.9,34 U$14.3 30.7,38.55 R8.2 29.6,39.45 | 29.6,39.45 29.4,39.45 | U$13.8 26.1,46.35 26.1,46.6 26.4,46.9 27.1,46.9 27.5,46.5 27.5,45.55 C6.2 | 29.9,39.45 29.6,39.45 | R6.1 29.85,39.5 29.9,39.45
  pour Top (no thermals): 25.3,45.4 25.3,46 26,46.7 26,49.9 25,50.9 25,51.2 23.3,52.9 23.3,56.1 23.9,56.7 25.2,56.7 27.1,54.8 30.7,54.8 30.8,54.7 34.4,54.7 34.6,54.5 34.6,53.4 34.2,53 31.7,53 30.9,53.8 28.9,53.8 27.6,52.5 27.6,51.5 30.8,48.3 30.8,46.9 29.5,45.6 29.5,45.1 29.2,44.8 27.1,44.8 26.6,45.3 25.4,45.3
15DB
  Top 0.152: U$14.4 28.4,36.3 R18.1
BCLK  (via drill 0.35)
  Top 0.152: v64.4,12.8 65.35,12.8 arc-45 67.59,11.87 v69.39,10.08 | v27.3,12.5 27.21,12.41 arc-45 26.7,12.2 arc-45 26.36,12.34 26.08,12.62 arc45 25.4,12.9 24.78,12.9 arc45 24.3,12.7 24.01,12.41 arc-45 23.5,12.2 22.48,12.2 arc-45 22,12.4 21.71,12.69 arc45 21.2,12.9 20.88,12.9 arc45 20.4,12.7 20.15,12.45 arc-45 19.3,12.1 arc-45 18.45,12.45 18.3,12.6 arc45 17.58,12.9 16.82,12.9 arc45 16.1,12.6 arc45 15.9,12.12 v15.9,11.7
  Bottom 0.152: v64.4,12.8 64.3,12.9 arc45 63.82,13.1 36.75,13.1 arc45 34.96,12.36 34.9,12.3 arc-45 33.21,11.6 28.57,11.6 arc-45 27.6,12 27.44,12.16 arc-45 v27.3,12.5 | 27.4,12.6 v27.3,12.5 | MIC_LEFT1.6 73.08,7.78 arc45 72.9,8.2 arc45 71.69,8.7 71.1,8.7 arc-45 70.53,8.94 v69.39,10.08 | v27.3,12.5 28.02,13.22 arc45 R12.2 28.5,15.85 C19.2 | MIC_RIGHT1.6 2.08,3.95 arc45 2.8,2.2 arc45 3.28,2 4.33,2 arc45 4.7,2.9 4.7,3.03 arc-45 5.1,4 arc-45 5.52,4.17 arc-45 6.04,3.96 6.64,3.36 arc45 8.5,2.59 arc45 9.2,2.88 9.42,3.1 arc45 9.6,3.54 9.6,3.8 arc45 9.32,4.48 7.98,5.82 arc-45 7.55,6.85 arc-45 7.85,7.55 arc-45 8.63,7.88 arc-45 9.13,7.67 10.15,6.65 arc45 11.48,6.1 arc45 12.2,6.4 arc45 12.49,7.11 arc45 11.74,8.92 arc-45 11.6,9.26 11.6,9.6 arc-45 11.74,9.94 12,10.2 arc-45 12.48,10.4 12.82,10.4 arc-45 13.3,10.2 14.29,9.21 arc45 14.8,9 15.12,9 arc45 15.6,9.2 15.62,9.22 arc45 15.9,9.9 v15.9,11.7
BCLK_98
  Top 0.152: U$13.16 21.96,44.45 arc45 21.6,44.3 21.34,44.04 arc45 21.2,43.7 21.2,41.1 21.05,40.95 | R10.2 21.05,40.95 | 21.05,40.95 C12.2
DATA  (via drill 0.35)
  Top 0.152: v72.9,6.5 arc45 73.38,6.3 77.22,6.3 arc90 77.9,6.98 77.9,12.8 arc90 77,13.7 67.63,13.7 66.67,14.66 arc45 64.88,15.4 40.25,15.4 arc-45 39.14,15.86 34.83,20.17 arc45 32.11,21.3 31.07,21.3 arc45 30.11,20.9 arc45 29.87,20.33 arc45 30.07,19.85 | v21,14.5 arc45 21.48,14.3 25.53,14.3 arc45 26.5,14.7 26.56,14.76 arc45 27.3,16.55 27.3,17.2 arc45 27.16,17.54 26.68,18.02 arc-45 26.4,18.7 26.4,18.96 arc-45 26.5,19.2 26.51,19.21 arc-45 v27.1,19.46 | v1.2,5.8 1.2,2.99 arc45 1.67,1.85 arc45 3.48,1.1 4.4,1.1 arc45 5.08,1.38 5.32,1.62 arc45 5.6,2.3 5.6,2.32 arc-45 5.8,2.8 arc-45 6.28,3 6.3,3 arc-45 6.81,2.79 8.2,1.4 | 30.07,19.85 v30.1,19.82 30.07,19.85 | 8.2,1.4 8.26,1.34 | 8.2,1.4 arc45 8.92,1.1 9.2,1.1 arc45 9.54,1.24 v13.9,5.6
  Bottom 0.152: v72.9,6.5 72.81,6.59 arc-45 MIC_LEFT1.7 | v21,14.5 20.97,14.5 arc45 20,14.1 arc45 19.8,13.62 19.8,12 arc-45 19.45,11.15 v13.9,5.6 | v1.2,5.8 1.2,6.98 arc-45 MIC_RIGHT1.7 | v27.1,19.46 29.22,19.46 arc45 v30.1,19.82 30.42,19.5 arc45 30.9,19.3 arc45 32.01,19.76 C18.2 32.15,21.28 arc-45 R13.2 arc-45 32.15,21.52 32.15,22.15 arc-45 32.89,23.94 33.3,24.35 R14.1
DATA_98
  Top 0.152: C11.2 23.85,40.95 R16.2 23.45,41.25 U$13.1
G6  (via drill 0.35)
  Top 0.152: v23.7,87.2 24.9,88.4 26.9,88.4 R1.2
  Bottom 0.152: v23.7,87.2 20.5,84 14.1,84 11.48,81.38 11.48,75.53 GPIO5,6,22.5
GAIN  (via drill 0.35)
  Top 0.152: U$13.2 23.95,43.05 24.6,42.4 25.5,42.4 v26.6,41.3
  Bottom 0.152: U$14.1 30.7,36 30.7,37.2 v26.6,41.3
GND  (via drill 0.35)
  Top 0.152: C10.2 32.7,87.3 v32.8,87.4 | U2.11 35.02,87.08 v34.6,87.5 | C101.P$2 30.65,50.35 29.82,51.17 U1.1 | C8.1 C6.1 v28.32,42.83 R8.1 29.2,41.95 29.2,43.75 C8.1 | C101.P$2 34.75,50.35 35.2,50.8 35.2,54.8 34.7,55.3 32.85,55.3 C100.P$2 | LED4.3-VSS 34.55,8.15 C1.1 | C101.P$2 v32.8,45.5 | IC2.26:A0 23.6,24.95 | C15.1 24.98,26.32 24.98,26.6 | IC2.26:A0 23.45,24.9 21.9,24.9 | 20.45,24.35 20.1,24.7 20.1,24.9 20.2,24.9 | 20.45,24.35 IC2.29 | 21.9,24.9 20.2,24.9 | 22.4,26.25 IC2.28:A2 24.4,26.25 | 22.4,26.25 21.8,26.25 | 21.8,26.25 21.55,26.25 21.1,25.8 | 21.1,25.8 20.2,24.9 | IC2.1:A3 22.45,26.3 22.4,26.25 | IC2.2:A4 21.8,26.25 | U$13.17 23.95,44.95 U$13.15 21.3,44.95 20.89,44.54 v20.43,44.54 20.43,43.33 v20.3,43.2 | U$13.17 23.95,45.45 U$13.11 | U$13.3 24.45,44.95 U$13.17 | U$14.5 26.65,34.05 | U$14.5 26.7,31.4 29.8,28.3 v31.89,28.3 | LED4.3-VSS 33.9,7.35 | 33.9,7.35 34.85,7.35 36.96,5.24 37.04,5.24 | 37.04,5.24 CON40.14 | 45.14,5.24 CON40.20 43.6,6.4 43.6,8.05 C2.1 42.55,8.15 41.8,7.4 | 57.66,7.26 LED1.3-VSS 58.55,8.15 C4.1 59.5,7.34 arc45 v59.6,7.1 | 57.66,7.26 57.46,7.06 CON40.30 | CON40.34 62.54,5.54 | LED4.3-VSS 32.2,8.9 28.25,8.9 C5.1 23.75,8.15 v23.6,8.3 | IC2.21:A5 23.2,21.3 23.5,21.6 IC2.22:EXTCLK 21.95,22.35 21.8,22.5 | 21.8,22.5 IC2.20:OE 21.8,20.3 21.4,19.9 19.2,19.9 17.5,18.2 v16.8,18.2 | 21.8,22.5 21.8,24.8 21.9,24.9 | 20.45,24.35 20.4,24.3 IC2.11:VSS 17.47,24.33 16.47,24.33 16.43,24.37 | 16.43,24.37 16,24.8 16,27.8 v16.2,28 | v23.9,28.4 24.98,27.32 24.98,26.6 | C100.P$2 27.55,55.35 24.1,58.8 v24.1,58.9 | U$11.2 23.07,83.83 24.07,84.83 | v25.4,86.8 25.4,86.7 24.2,85.5 R2.2 24.12,84.83 24.07,84.83
  Top 0.152: U$11.2 26.07,76.9 v27.7,76.9 | v33.4,78.1 33.1,77.8 C7.2 | C13.1 18.2,37.7 v18,37.5 | v14.9,37 13.8,35.9 U$16.3:GND3 | C12.1 v22.4,37.4 | U$11.2 24.4,78.58 24.4,77 v24.6,77 | v12.3,67.5 12.4,67.4 13.3,67.4 13.9,66.8 13.9,63.77 v13.67,63.54 | v23.9,28.4 25.2,29.7 25.2,32.6 26.65,34.05 | v16.2,28 12.1,28 v10.9,26.8 10.9,28.41 v11.33,28.84 | v35,18.5 35.5,18.5 36.9,17.1 v36.9,15.7 36,14.8 v35.5,14.8 | C3.1 50.7,7.35 LED2.3-VSS 47.92,7.35 v47.73,7.54 | CON40.9 30.05,0.69 15.27,0.69 15.27,0.7 13.5,0.7 v12.7,1.5 11.39,1.5 v11.03,1.14 10.38,0.49 7.87,0.49 7.33,1.04 v6.63,1.04 | LED3.3-VSS 41.8,7.4 | C3.1 51.85,8.15 | v26.1,17.1 26,17.1 26,16.71 v24.53,15.24 | 24.4,26.25 24.62,26.25 24.98,26.6 | C8.1 30.65,43.75 v30.8,43.9 | 21.7,25.7 21.8,25.6 IC2.27:A1 23.6,25.7 24.2,25.7 24.4,25.9 24.4,26.25 | U$13.11 23.9,46.75 | IC2.26:A0 21.95,24.95 21.7,25.2 | 21.7,25.2 21.3,25.6 | 21.3,25.6 21.1,25.8 | IC2.29 20.5,25.6 21.3,25.6 | IC2.29 20.5,25.2 21.7,25.2 | LED0.3-VSS 64.35,7.35 62.54,5.54 | CN1.1 21.8,87.6 21.8,85.8 22.77,84.83 24.07,84.83 | GPIO5,6,22.1 11.78,70.35 8.85,70.35 7.8,71.4 7.8,76.38 12.43,81 U$12.2 15.12,80.8 15.12,80.75 15.24,80.64 v15.24,80.01 | v16.7,46.6 13.86,46.6 | 13.86,46.6 U$10.3:GND3 | U$13.11 23.95,47.35 23.5,47.8 22.6,47.8 v22.3,47.5 | v11.2,45.4 12.4,46.6 13.86,46.6 | v22.7,33.1 22.9,33.3 25.1,33.3 25.85,34.05 26.65,34.05 | v12.1,11.2 13.5,9.8 14.59,9.8 v14.83,10.04 19.96,10.04 v21.2,8.8 21.2,10 21.8,10.6 26.1,10.6 27.44,11.94 27.53,11.94 28.09,12.5 v29.7,12.5 30.35,13.15 30.7,13.15 30.93,13.37 v30.93,14.04 | v13.5,13.3 13.5,14.2 14.2,14.9 15.27,14.9 | MIC_RIGHT1.4 3.3,9.3 3.3,13.2 4.38,14.29
  Top 0.152: v7.8,44.56 7.4,44.16 7.4,33 1.44,27.04 v0.93,27.04 | LED5.CATHODE 17.7,52.9 v17.5,53.1 | v15.24,77.47 v13.97,78.74 v12.67,80.04 | v13.97,76.2 12.74,77.43 v12.74,77.47 | v1.27,78.74 v2.54,77.47 | v1.27,76.2 v2.54,74.93 | v1.27,73.66 v2.54,72.39 | v1.27,71.12 v2.54,69.85 | v1.27,67.31 v2.54,66.04 | v5.08,73.66 6.35,72.39 v6.35,71.12 | v1.27,60.96 v1.27,55.88 4.93,52.22 v4.93,51.34 | v39.37,17.78 38.22,17.78 v37.3,18.7 37.3,20.1 v36,21.4 35.8,21.61 30.38,21.61 29.54,20.77 29.54,19.59 29.87,19.26 34.02,19.26 37.9,15.39 v37.9,14.9 38.09,14.71 v42.19,14.71 42.29,14.61 v47.09,14.61 47.19,14.51 v52.19,14.51 52.29,14.61 v57.29,14.61 v62.99,14.61 | v41.91,19.05 v44.45,16.51 44.25,16.71 v41.69,16.71 41.59,16.61 v40.09,16.61 | v46.99,19.05 49.37,16.67 | 49.37,16.67 v49.53,16.51 | v52.07,19.05 54.51,16.61 | v57.15,19.05 v59.69,16.51 59.59,16.61 v57.19,16.61 | 61.04,17.86 v60.96,17.78 62.39,16.35 v62.39,16.31 | 61.04,17.86 62.23,19.05 v63.5,19.05 | U$14.5 25.9,34.8 25.9,35.3 25.6,35.6 25.4,35.6 24.9,36.1 R18.2 24.9,38.95 C11.1 26.31,38.14 v26.73,38.14 28.43,38.14 v28.53,38.04 | R24.1 35,75.3 34.7,75 v34.1,75 | v49.39,18.71 48.49,19.61 v48.49,20.61 | v44.39,18.81 44.39,19.31 v45.69,20.61 | v53.39,20.71 54.59,19.51 v54.59,18.81 | v59.39,18.81 60.34,17.86 61.04,17.86 | v52.09,16.61 54.51,16.61 | 54.51,16.61 v54.61,16.51 | v46.89,16.61 49.31,16.61 49.37,16.67 | v34.73,36.34 34.73,35.04 v35.43,34.34 34.03,32.94 v34.03,32.44 34.03,31.74 v35.43,30.34 34.53,29.44 v34.53,27.54 35.4,26.67 35.4,24.6 34.88,24.09 | v34.73,36.34 33.23,34.84 v32.93,34.84 31.7,36.07 v31.7,36.8 32.8,37.9 CN2.1
  Top 0.152: v34.73,36.34 35.53,37.14 v35.53,38.44 35.53,39.74 v34.43,40.84 34.43,42.14 v33.83,42.74 | v33.83,42.74 35.04,42.74 35.2,42.9 35.57,42.9 v35.73,42.74 | v33.83,42.74 34.53,43.44 v34.53,44.74 | C100.P$2 33.94,55.35 v35.33,56.74 | v9.67,62.34 9.67,61.14 v11.17,59.64 11.67,60.14 v13.47,60.14 | v7.83,53.64 8.16,53.64 8.86,52.94 10.33,52.94 v10.63,52.64 11.44,53.45 I2C.1 | v1.03,12.04 1.03,9.37 1.8,8.6 MIC_RIGHT1.4 | v3.63,4.04 3.63,4.74 v5.03,6.14 | v5.03,6.14 4,7.17 MIC_RIGHT1.4 | v7.03,4.84 5.73,6.14 v5.03,6.14 | v7.03,4.84 8.73,6.54 v8.73,6.64 | v8.73,6.64 6.83,8.54 | 6.83,8.54 v6.83,9.24 | 6.83,8.54 6.77,8.6 MIC_RIGHT1.4 | v8.73,6.64 10.7,4.67 v10.7,4.4 11.34,5.04 v11.63,5.04 | v10.83,8.04 9.4,9.47 v9.4,9.8 | v12.67,9.37 12.1,9.95 v12.1,11.2 | v12.1,11.2 10.56,12.74 v10.53,12.74 | v4.53,14.14 4.38,14.29 | 4.38,14.29 3.83,14.84 v3.83,16.44 | v3.83,16.44 4.43,17.04 v5.73,17.04 4.43,18.34 4.43,18.7 | v5.73,21.14 4.43,19.84 v4.43,18.74 4.43,18.7 | v5.73,21.14 7.13,22.54 v7.33,22.54 5.83,24.04 v5.63,24.04 | v5.73,21.14 6.63,21.14 v8.03,19.74 8.03,17.77 8.7,17.1 11.43,17.1 I2S0(DAP4)1.1 | v5.63,24.04 5.89,24.3 9.3,24.3 v9.8,24.8 10.3,24.8 11.16,23.94 v11.63,23.94 | v14.63,28.74 15.46,28.74 v16.2,28 | v16.2,28 16.2,28.31 v17.03,29.14 v18.93,29.14 | v15.93,31.54 16.13,31.74 v16.13,34.14 | v31.89,28.3 v30.73,27.14 30.43,26.84 v28.63,26.84 26.93,28.54 v26.83,28.54 24.04,28.54 v23.9,28.4 | v31.89,28.3 v31.9,28.3 32.73,29.13 v32.73,29.94 v29.43,29.94 | v23.9,28.4 23.17,28.4 v22.23,29.34 | 15.27,14.9 v15.43,14.74 15.73,15.04 17.86,15.04 18.3,14.6 19.09,14.6 v19.93,15.44 21.56,15.44 22,15 24.29,15 v24.53,15.24
  Top 0.152: v24.53,15.24 24.43,15.24 v23.53,16.14 | v27.83,24.64 29.64,24.64 29.8,24.8 31.27,24.8 v31.33,24.74 34.23,24.74 34.88,24.09 | 34.88,24.09 v34.93,24.04 | v64.03,9.64 64.03,8.84 v63.03,7.84 63.03,7.03 62.54,6.54 62.54,5.54 | C3.1 51.75,8.4 54.57,8.4 v55.33,7.64 57.28,7.64 57.66,7.26 | 37.04,5.24 39.34,7.54 v39.63,7.54 41.66,7.54 41.8,7.4 | v31.53,7.64 33.61,7.64 33.9,7.35 | v5.63,34.64 5.43,34.84 v5.43,38.04 | v7.93,29.14 7.93,29.34 v6.73,30.54 5.43,29.24 v5.43,29.04 4.7,28.31 4.7,24.97 v5.63,24.04 | v3.83,16.44 0.93,19.34 v0.93,20.04 | v21.63,46.34 21.03,46.94 v21.03,47.5 | v7.03,4.84 7.33,4.84 v8.43,3.74 | 4.43,18.7 4.07,18.7 v3.03,19.74 2.83,19.94 v2.83,23.84 2.83,26.77 v2.8,26.8 | v13.79,7.75 18.31,7.75 v18.47,7.59 | v25.87,68.84 25.87,71.14 v25.77,71.24 27.16,71.24 C21.1 | v25.87,68.84 27.27,67.44 v27.27,67.24 27.27,66.84 v25.97,65.54 | v24.97,67.24 24.97,67.94 v25.87,68.84 | v16.13,22.74 16.13,24.07 16.43,24.37 | v14.93,17.14 14.93,15.24 15.27,14.9
  Top 0.406: CN2.1 32.9,45.4 v32.8,45.5
  Bottom 0.152: v31.9,28.3 33.3,26.9 R14.2 34.8,26 36,24.8 v36,21.4 36.1,21.5 36.8,21.5 37.7,20.6 40.47,20.6 arc45 v40.49,20.61 v43.09,20.61 v45.69,20.61 v48.49,20.61 v50.99,20.61 53.15,20.61 | 20.25,43.25 v20.3,43.2 | v16.2,28 16.6,28.4 v23.9,28.4 | v24.1,58.9 24.1,68.8 C9.1 | C21.1 C9.1 | C21.1 32.8,75 v34.1,75 34.1,73.87 v33.07,72.84 34.37,72.84 v35.17,72.04 v35.17,64.94 35.33,64.78 v35.33,56.74 35.33,50.04 v34.33,49.04 34.1,48.81 v34.1,47.1 | 25.45,86.85 26.2,87.6 26.2,89.5 26.6,89.9 31.1,89.9 32.8,88.2 v32.8,87.4 34.5,87.4 v34.6,87.5 34.6,83.71 v34.87,83.44 v34.87,81.74 34.07,81.74 v33.27,82.54 32.67,82.54 v31.67,83.54 v31.67,81.74 | 25.45,86.85 v25.4,86.8 | v27.7,76.9 27.75,76.95 | 27.75,76.95 28.9,78.1 v33.4,78.1 | C21.1 27.75,70.65 27.75,76.95 | MIC_RIGHT1.2 2.08,8.62 2.2,8.5 3.9,8.5 MIC_RIGHT1.4 4.55,9.15 C16.1 v6.3,11.3 7.9,11.3 v9.4,9.8 | 15,37 17.5,37 v18,37.5 18.15,37.35 17.93,37.13 v17.93,35.74 17.93,35.7 | 15,37 v14.9,37 | v24.6,77 24.6,72.3 C9.1 | v20.3,43.2 20.3,39.5 v22.4,37.4 25.8,34 U$14.5 | v10.9,26.8 9.8,25.7 v9.8,24.8 | C20.1 v36.9,15.7 | C18.1 33.85,19.65 v35,18.5 35.2,18.7 v37.3,18.7 39.08,18.7 v39.29,18.91 | C17.1 75.55,9.15 75.15,8.75 | 75.15,8.75 MIC_LEFT1.4 73.4,8.6 73.08,8.93 MIC_LEFT1.2 MIC_LEFT1.1 71,11.1 71,11.2 | CON40.39 71.2,2.7 72.66,1.24 v73.73,1.24 77.23,1.24 v77.73,1.74 77.93,1.94 v77.93,5.14 78,5.21 78,7.7 76.95,8.75 75.15,8.75 | CON40.25 50.58,0.9 33.86,0.9 CON40.9 | v12.7,1.5 10.7,3.5 v10.7,4.4 | v35.5,14.8 35.5,14.4 33.6,12.5 v29.7,12.5 | v21.2,8.8 23.1,8.8 v23.6,8.3 | C19.1 26.85,16.35 v26.1,17.1 | v32.8,45.5 31.2,43.9 v30.8,43.9 31.1,43.6 v31.1,42.7 33.79,42.7 v33.83,42.74
  Bottom 0.152: 71,11.2 71,11.9 69.21,13.69 67.71,13.69 65.6,15.8 65.6,19.6 64.69,20.51 v64.19,20.51 v60.99,20.51 arc45 60.75,20.61 v58.29,20.61 arc45 58.05,20.71 v55.99,20.71 arc-45 55.75,20.61 53.15,20.61 | 20.25,43.25 22.3,45.3 v22.3,47.5 v22.3,48.77 v21.03,47.5 v19.76,46.23 v19.76,48.77 | v59.6,7.1 60.68,7.1 CON40.34 | v12.3,67.5 12.18,67.62 GPIO5,6,22.1 11.28,69.85 8.89,69.85 7.62,71.12 v6.35,71.12 | v16.7,46.6 16.9,46.6 20.25,43.25 | 12.18,53.4 12.18,51.45 11.03,50.3 9.8,50.3 9.3,49.8 9.3,47 10.3,46 10.6,46 v11.2,45.4 8.64,45.4 v7.8,44.56 6.52,45.84 v4.13,45.84 2.83,44.54 v2.83,40.64 | 12.18,53.4 I2C.1 | v12.1,11.2 12.1,11.4 13.5,12.8 v13.5,13.3 | I2S0(DAP4)1.1 16.45,17.85 v16.8,18.2 | v17.5,53.1 17.2,53.4 12.18,53.4 | v16.2,42.67 17.47,43.94 v17.73,43.94 18.24,43.44 v18.24,42.42 19.07,43.25 20.25,43.25 | v15.24,80.01 v13.97,78.74 | v15.24,77.47 v13.97,76.2 | v2.54,80.01 v1.27,78.74 | v1.27,76.2 v2.54,77.47 3.81,76.2 8.03,76.2 v10.37,78.54 9.57,79.34 v9.57,80.14 | v1.27,73.66 v2.54,74.93 3.81,74.93 v5.08,73.66 | v2.54,72.39 v1.27,71.12 | v2.54,69.85 2.54,68.58 v1.27,67.31 | v2.54,66.04 v1.27,64.77 v1.27,60.96 | v1.27,55.88 v5.08,59.69 | v39.37,17.78 40.64,19.05 v41.91,19.05 | v44.45,16.51 v46.99,19.05 | v49.53,16.51 v52.07,19.05 | v54.61,16.51 v57.15,19.05 | v59.69,16.51 v60.96,17.78 | v63.5,19.05 v64.77,17.78 | 53.15,20.61 arc45 v53.39,20.71 | 71,11.2 70.94,11.14 v70.43,11.14 69.63,11.94 v69.13,11.94 68.34,11.15 68.34,9.49 69.28,8.55 v69.28,7.72 | v34.53,44.74 34.1,45.17 v34.1,47.1 | v34.1,47.1 34.56,46.64 v35.83,46.64 | v31.93,48.04 33.16,48.04 v34.1,47.1 | v20.07,87.64 19.7,88.01 CN1.1
  Bottom 0.152: CN1.1 19.7,91.97 v20.07,92.34 | CN1.1 19.06,90.34 v17.67,90.34 15.07,92.94 v15.07,93.34 14.1,94.31 14.1,97.67 v15.07,98.64 | CN1.1 20.74,90.74 v22.47,90.74 v22.47,88.54 23.87,89.94 v24.87,89.94 24.87,87.43 25.45,86.85 | v15.07,98.64 18.77,98.64 v18.87,98.54 | v15.07,98.64 v8.87,98.64 4.57,98.64 v4.47,98.74 3.67,98.74 v1.27,96.34 | v13.47,60.14 13.47,60.54 v14.77,61.84 | v14.77,61.84 13.67,62.94 v13.67,63.54 | v14.77,61.84 15.87,62.94 v15.87,63.54 | v14.77,61.84 14.77,60.94 v15.67,60.04 | v4.93,51.34 4.93,52.83 5.8,53.7 7.77,53.7 v7.83,53.64 | v5.03,42.04 6.53,40.54 v6.53,40.24 | v6.53,40.24 6.59,40.3 | 6.59,40.3 8.23,41.94 v8.23,42.34 8.63,42.74 v11.13,42.74 11.63,42.24 v11.63,39.44 12.23,40.04 v13.33,40.04 | v5.43,38.04 6.53,39.14 v6.53,40.24 | v11.43,31.44 v11.43,34.04 11.43,36.64 v11.73,36.94 13.03,38.24 v13.33,38.24 v13.33,40.04 | v13.33,40.04 14.73,40.04 v15.23,39.54 16.13,38.64 v16.13,38.14 v16.13,38.13 15,37 | v8.43,37.94 8.43,39.47 7.59,40.3 6.59,40.3 | v0.93,34.04 v0.93,27.04 v0.93,20.04 0.93,12.14 v1.03,12.04 | v16.13,34.14 v18.43,34.14 | v18.43,34.14 17.93,34.64 17.93,35.7 | v19.43,35.64 17.99,35.64 17.93,35.7 | v18.43,34.14 19.47,33.1 v22.7,33.1 | v20.3,43.2 20.9,42.6 v22.3,42.6 28.1,42.6 v28.32,42.83 | v18.93,29.14 22.03,29.14 v22.23,29.34 | v14.13,12.14 13.5,12.77 v13.5,13.3 | v13.5,13.3 12.66,14.14 v12.53,14.14 | CON40.20 45.92,6.4 46.3,6.4 47,7.1 47,7.3 47.24,7.54 v47.73,7.54 | v11.33,28.84 5.63,34.54 v5.63,34.64 | v2.8,26.8 2.8,30.91 v2.83,30.94 | v13.79,7.75 12.67,8.86 v12.67,9.37 | v18.47,7.59 19.36,6.71 v19.36,5.59
  pour Top (rank 6): -16.7,101.9 83.6,101.9 83.6,-7.6 -16.7,-7.6
  pour Bottom (rank 6): -18.8,103.2 85.5,103.2 85.5,-9.7 -18.8,-9.7
GPIO2/SDA1  (via drill 0.35)
  Top 0.152: v16.5,50.6 16.5,57.43 arc45 16.1,58.4 arc45 15.38,58.7 14,58.7 arc45 12.89,58.24 I2C.5 | v13.8,4 13.8,3.5 arc90 15.8,1.5 18.7,1.5 arc90 19.8,2.6 19.8,2.7 arc-90 21.1,4 23.14,4 arc-90 CON40.3 | IC2.24:SDA 24.81,23.65 arc-45 25.79,23.25 arc-45 26.15,22.39 arc-45 25.86,21.69 23.04,18.88 arc45 22.3,17.08 v22.3,15.8 21.34,16.76 arc-45 21.2,17.1 21.2,17.18 arc45 20.9,17.9 arc45 20.18,18.2 v19.9,18.2
  Bottom 0.152: 15.3,25.4 15.3,22.8 arc45 16.36,20.24 17.66,18.94 arc45 19.45,18.2 v19.9,18.2 | 15.3,25.4 15.3,25.5 | v16.5,50.6 15.6,49.7 15.6,48.4 11.2,44 4.6,44 3.6,43 3.6,38.85 arc45 4.34,37.06 14.8,26.59 arc-45 15.3,25.4 | v22.3,15.8 22.3,13.85 arc-45 21.56,12.06 14.01,4.51 arc-45 v13.8,4 | I2C.5 12.18,64.2 12.18,64.28 12.18,64.29 arc-45 12.6,65.3 arc-45 13.57,65.7 R23.1
GPIO3/SCL1  (via drill 0.35)
  Top 0.152: v13.1,25.8 14.4,24.5 arc-45 14.9,23.29 14.9,19.05 arc45 15.5,17.6 16.09,17.01 arc45 16.6,16.8 arc-45 17.59,16.39 17.95,16.03 arc45 v18.5,15.8 18.55,15.85 18.55,17.2 arc-45 19.2,18.78 arc-45 20.22,19.2 20.57,19.2 arc45 23.81,20.54 25.11,21.84 arc45 25.32,22.36 arc45 25.14,22.8 arc45 24.66,23 IC2.23:SCL | v2.2,53.8 arc45 2,53.32 v2,36.7
  Bottom 0.152: v13.1,25.8 2.2,36.7 v2,36.7 | v18.5,15.8 arc-45 19,14.59 19,12.2 arc-45 18.72,11.52 12.7,5.5 arc45 12.4,4.78 12.4,4.35 arc45 13.14,2.56 14.36,1.34 arc45 16.15,0.6 26.42,0.6 arc45 26.9,0.8 arc45 26.98,0.99 CON40.5 | I2C.4 5.96,56.51 arc45 4.17,55.77 v2.2,53.8 2.96,53.04 arc-45 3.7,51.25 3.7,48.85 R22.1
GPIO6
  Top 0.152: U2.20 29.18,84.58 28.9,84.3 28.1,84.3 27.4,85 27.4,86.1 | 27.4,86.1 27.4,86.2 | 27.4,86.2 R1.1 | R5.2 R3.2 24.8,82.1 24.8,83.7 25.8,84.7 R2.1 25.8,85.7 26.3,86.2 27.4,86.2 | 27.05,86.1 27.4,86.1
GPIO6/GPIO_PZ0  (via drill 0.35)
  Top 0.152: U2.1 29.18,78.97 28.4,78.2 27.4,78.2 27,78.6 | v24.6,11.7 24.1,11.2 18.3,11.2 v17.8,11.7 | v3.7,33.3 3.7,42.4 9.5,48.2 v10.4,48.2 | v15.3,57.8 15.29,57.8 14.94,57.46 v14.94,51.3 | 27,78.6 R5.1 | v26.3,78.2 26.7,78.6 27,78.6
  Bottom 0.152: v17.8,11.7 17.2,11.7 13.8,15.1 9.4,15.1 3.7,20.8 v3.7,33.3 | v10.4,48.2 10.6,48.4 13.1,48.4 15,50.3 15,51.24 v14.94,51.3 | v15.3,57.8 17.2,59.7 17.2,66.8 15.5,68.5 15.5,71.72 21.88,78.1 26.2,78.1 v26.3,78.2 | v24.6,11.7 27.1,11.7 29.7,9.1 29.7,7.1 30.14,6.66 40.34,6.66 41,6 41,4.48 41.48,4 57.9,4 arc-45 59.27,3.43 CON40.31
GPIO10/SPI1_MOSI
  Top 0.152: CON40.19 arc-90 46.06,4 68.5,4 arc90 68.94,4.44 68.94,5.22 arc45 67.36,9.04 LED0.4-DIN
GPIO18/I2S0_SCLK  (via drill 0.35)
  Top 0.152: v24.7,17.4 24.7,19.22 arc-45 25.04,20.04 26.89,21.89 arc45 27.1,22.4 27.1,22.98 arc45 v26.8,23.7 | v25.7,6.3 25.7,4.84 arc45 25.96,4.21 arc45 26.7,3.9 33.7,3.9 arc45 34.38,4.18 34.4,4.2 arc45 34.6,4.68 CON40.12 | v22.1,30.8 arc-45 21.24,31.16 arc-45 20.8,32.22 20.8,33.36 arc45 20.7,33.6 arc-45 20.36,33.74 20.2,33.9 arc-45 20,34.38 20,34.42 arc-45 20.2,34.9 arc-45 20.44,35 21.96,35 arc45 22.2,35.1 22.36,35.26 arc45 22.62,35.89 arc45 22.43,36.34 22.2,36.58 arc45 21.9,36.7 21.38,36.7 arc-45 20.9,36.9 arc-45 20.7,37.38 20.7,39 R10.1
  Bottom 0.152: 26.4,14.5 26.6,14.5 | 26.6,14.5 26.7,14.5 | 26.7,14.5 R12.1 arc-45 27,14.14 27,13.6 arc-45 26.93,13.43 26.7,13.2 arc-45 26.46,13.1 23.72,13.1 arc45 23,12.8 22.91,12.71 arc45 22.52,11.77 arc45 22.75,11.2 arc45 23.97,10.7 25.5,10.7 arc-45 28.1,9.62 28.37,9.35 arc-45 28.6,8.8 28.6,8.54 arc-45 28.35,7.93 arc-45 27.3,7.5 arc-45 26.79,7.71 26.48,8.02 arc45 25.8,8.3 25.75,8.3 arc-45 23.96,9.04 23.2,9.8 arc45 21.76,10.4 21.27,10.4 arc45 20.3,10 arc45 20.1,9.52 20.1,8.8 arc45 20.31,8.29 21.3,7.3 arc45 22.27,6.9 22.82,6.9 arc45 23.3,7.1 23.32,7.12 arc-45 24.26,7.51 arc-45 25.39,7.04 arc-45 v25.7,6.3 25.7,6.39 | v26.8,23.7 arc-45 26.5,24.42 26.5,26.95 arc45 25.9,28.4 24.1,30.2 arc45 22.65,30.8 v22.1,30.8 | 26.7,14.5 arc-45 25.55,14.98 arc-45 25.3,15.57 25.3,16.2 arc45 24.88,17.22 v24.7,17.4 R19.1 | 26.6,14.22 26.6,14.5
GPIO19/I2S0_FS  (via drill 0.35)
  Top 0.152: v29.8,23.4 29.8,22.77 arc-45 29.4,21.8 29.35,21.75 arc45 29,20.9 29,19.38 arc45 29.2,18.9 30.06,18.04 arc45 31.85,17.3 31.99,17.3 arc-45 33.2,16.8 33.83,16.17 arc45 34.48,15.9 35.06,15.9 arc45 35.32,16.01 arc45 35.5,16.44 v35.5,17 | v19.8,37.4 arc-45 19.6,37.88 R9.1
  Bottom 0.152: v29.8,23.4 29.8,26.29 arc45 28.88,28.52 22.04,35.36 arc45 20.84,35.86 arc-90 19.8,36.9 v19.8,37.4 | CON40.35 arc45 65.8,3 66.02,3.22 arc45 66.3,3.9 66.3,11.33 arc45 65.33,13.67 64.1,14.9 arc45 62.65,15.5 39,15.5 arc-45 38.49,15.71 37.54,16.66 arc45 36.71,17 v35.5,17 35,17.5 arc45 34.76,17.6 34.28,17.6 arc45 R11.1 33.8,17.48 arc45 33.5,18.2 arc45 32.53,18.6 31.78,18.6 arc45 31.3,18.4 arc-45 30.82,18.2 R15.1
GPIO20/I2S0_DIN  (via drill 0.35)
  Top 0.152: v30.8,22.2 arc-45 31.15,23.05 31.2,23.1 arc-45 31.92,23.4 32.5,23.4 arc-45 33.18,23.12 v33.6,22.7
  Bottom 0.152: CON40.38 67.62,11.63 arc45 66.88,13.42 61,19.3 arc45 59.79,19.8 36.67,19.8 arc-45 34.92,20.52 34.23,21.22 arc45 R13.1 33.8,22.22 arc45 v33.6,22.7 | R20.1 30.55,21.6 arc45 v30.8,22.2
GPIO21/I2S0_DOUT  (via drill 0.35)
  Top 0.152: v28.1,22 28.1,19.29 arc45 28.44,18.46 29.8,17.1 arc45 31.49,16.4 32,16.4 arc-45 32.68,16.12 32.7,16.1 arc-45 32.9,15.62 32.9,15.47 arc-45 32.5,14.5 arc45 32.4,14.26 32.4,13.8 arc90 33.2,13 60.79,13 arc-45 62,12.5 arc45 63.45,11.9 66.1,11.9 arc-45 66.44,11.76 69.42,8.78 arc-45 70.16,6.99 CON40.40 | R16.1 23.8,37.58 arc-45 23.6,37.1 23.51,37.01 arc45 23.3,36.5 arc45 23.65,35.65 23.79,35.51 arc45 24.3,35.3 arc-45 24.64,35.16 24.8,35 arc-45 25,34.52 25,34.44 arc-45 24.9,34.2 arc-45 24.42,34 22.42,34 arc45 21.65,33.68 arc45 21.6,33.56 21.6,33 arc45 21.74,32.66 21.99,32.41 arc45 22.5,32.2 23.12,32.2 arc-45 v23.6,32
  Bottom 0.152: v28.1,22 28.1,23 arc-45 28.52,24.02 29.03,24.53 arc45 29.1,24.7 29.1,24.96 arc45 29,25.2 28.84,25.36 arc45 28.5,25.5 27.84,25.5 arc-45 27.43,25.67 27.34,25.76 arc-45 27.2,26.1 27.2,26.73 arc-45 27.6,27.7 arc45 27.7,27.94 27.7,28.52 arc45 27.5,29 27.35,29.15 arc45 26.5,29.5 arc-45 25.82,29.78 v23.6,32
JETSON3V3  (via drill 0.35)
  Top 0.152: CON40.17 42.22,2.08 43.5,0.8 71,0.8 71.9,1.7 71.9,6.7 71.2,7.4 71.2,10.8 72.6,12.2 v73.2,12.2 | C7.1 29.98,77.88 | 29.98,77.88 29.82,78.03 U2.2 | SJ3.1 36.1,87.79 36.1,75.2 34.8,73.9 31.5,73.9 30.1,75.3 R4.2 29.98,76.33 29.98,77.88 | 29.82,80.08 U2.2 | v19.33,8.43 19.26,8.51 12.09,8.51 v9.2,11.4 | U2.2 29.82,81.08 29.6,81.3 v28.6,81.3 27.2,81.3 R3.1
  Bottom 0.152: MIC_RIGHT1.3 2.73,11.1 | 2.73,11.1 2.73,11.18 C16.2 1.8,11.3 1.43,10.93 MIC_RIGHT1.1 | v19.33,8.43 19.38,8.43 20.34,7.48 20.34,4.26 CON40.1 22.7,3.5 arc-45 23.91,4 39.87,4 arc-45 41.66,3.26 CON40.17 | v9.2,11.4 7.9,12.7 3,12.7 2.7,12.4 | 2.7,12.4 2.7,11.12 2.73,11.1 | 2.7,12.4 1.9,13.2 1.9,35.5 0.9,36.5 0.9,45.7 2.05,46.85 R22.2 2.05,52.05 1.2,52.9 1.2,54.2 5.1,58.1 6.4,58.1 8.6,60.3 9.5,60.3 10.8,61.6 10.8,64.9 13,67.1 14.1,67.1 14.7,67.7 | v73.2,12.2 73.85,11.55 C17.2 73.72,11.07 MIC_LEFT1.3 | 14.7,67.7 14.7,72.4 22.8,80.5 24.3,80.5 24.7,80.1 28.1,80.1 28.6,80.6 v28.6,81.3 | R23.2 15.25,67.15 14.7,67.7
JETSON　5V  (via drill 0.35)
  Top 0.152: SJ3.2 SJ3.3 30.8,89.4 29.85,88.45 C10.1 29.82,87.28 U2.19 29.82,83.83 v29.2,83.2 28.9,82.9 v27.5,82.9 26.9,83.5 v26.1,83.5 | C100.P$1 30.65,59.45 29.82,58.62 U1.3 28.2,56.6 v27.6,57.2 v26.5,58.3 26,58.8 v26,59.9 27,59.9 v27.6,59.3 28.7,59.3 v29.2,59.8 29.2,58.8 v28.7,58.3 | C5.2 27.57,9.93 | 37.1,10.65 LED3.1-VDD | LED0.1-VDD 61.25,11.05 | LED1.1-VDD 53.25,10.85 | 45.4,10.8 LED2.1-VDD 44.3,10.65 C2.2 | 29.25,10.85 LED4.1-VDD | CN3.1 17.6,49.3 R21.2
  Top 0.305: 12.5,32.8 13.6,32.8 U$16.2:VCC3 | U$10.2:VCC3 13.7,44 | 11.3,47.7 10.3,46.7 10.3,44.4 10.6,44.1 | 11.3,47.7 13.8,50.2 13.8,54.9 13.21,55.49 I2C.3 | 11.3,47.7 11.3,50.5 9.5,52.3 6.5,52.3 2.9,55.9 2.9,61.8 5.6,64.5 9.5,64.5 10.1,65.1 10.1,68 10.8,68.7 13.6,68.7 14.1,69.2 14.1,72 13.31,72.79 GPIO5,6,22.3 | 13.11,19.89 13.09,19.89
  Top 0.406: CON40.2 21.9,8.2 23.62,9.93 27.57,9.93 | C5.2 28.3,10.65 LED4.1-VDD 30.7,12.1 35.65,12.1 37.1,10.65 | C1.2 36.3,10.65 LED3.1-VDD 38.9,12.3 44.2,12.3 45.4,11.1 45.4,10.8 | LED2.1-VDD 46.9,12.3 51.6,12.3 53.15,10.75 | 53.15,10.75 LED1.1-VDD 54.9,12.3 59.6,12.3 LED0.1-VDD 60.3,10.65 C4.2 | C3.2 52.4,10.75 53.15,10.75
  Top 0.508: CON40.2 20.44,6.7 10.1,6.7 7.8,9 7.8,11.6 12,15.8 13.3,15.8 14,16.5 14,19 13.11,19.89 | I2S0(DAP4)1.3 13.11,19.89 | 13.11,19.89 14,20.78 14,23.4 12.1,25.3 10.8,25.3 9.8,26.3 9.8,31.5 11.1,32.8 | 13.6,32.8 11.1,32.8 | 11.1,32.8 9.6,34.3 9.6,43.1 10.6,44.1 10.7,44 14.4,44 | 13.7,44.1 U$10.2:VCC3
  Top 0.61: CN3.1 18.2,48 18.2,46.1 16.1,44 14.4,44 13.7,44
  Bottom 0.152: v27.6,57.2 27.2,57.6 26.2,57.6 24.09,55.49 I2C.3
  Bottom 0.305: GPIO5,6,22.3 12.21,72.79 12.25,72.75 23,83.5 v26.1,83.5
  pour Top (no thermals): 27.7,56.2 25.3,58.6 25.3,59.4 25.3,59.9 25.9,60.5 35,60.5 35.4,60.1 35.4,59.4 34.6,58.6 33.7,58.6 32.7,57.6 32.3,57.6 30.8,56.1 27.8,56.1
  pour Bottom: 11.2,54.9 11.2,56.1 11.4,56.3 22.7,56.3 25.1,58.7 25.1,60.2 25.8,60.9 29.8,60.9 30.9,59.8 30.9,56.6 29,54.7 11.4,54.7
  pour Bottom (no thermals): 23.1,83.5 23.9,84.3 30.3,84.3 30.7,83.9 30.7,83.1 29.9,82.3 28.1,82.3 28,82.2 23.7,82.2 23.1,82.8
  pour Top (no thermals): 25.6,83.1 25.6,83.8 25.8,84 27.5,84 27.9,83.6 28.9,83.6 29.8,84.5 29.8,84.7 29.9,84.7 29.9,84.6 30.5,84 30.5,83.7 29.2,82.4 26.3,82.4
  pour Top (no thermals): 20.9,5.1 20.9,7.5 23.5,10.1 26.9,10.1 28.6,11.8 30,11.8 30.1,11.9 30.7,12.5 31.3,12.5 61.2,12.5 62.7,11 62.7,10.4 61.8,9.5 59.1,9.5 58.6,9 58.3,8.7 57.4,8.7 46.8,8.7 46.4,9.1 46.1,9.4 45.5,9.4 42.9,9.4 42.2,8.7 38.5,8.7 37.8,9.4 34.9,9.4 34.1,8.6 33.5,8.6 32.8,9.3 23.4,9.3 22.9,8.8 22.8,8.7 22.8,5 22.8,4.8 22.5,4.5 21.2,4.5 20.9,4.8
MONO
  Top 0.152: R6.2 27.6,41.2 27.6,41.9 27,42.5 26.6,42.5 25.9,43.2 25.4,43.2 24.95,43.65 U$13.4
N$1  (via drill 0.35)
  Top 0.152: LED1.4-DIN 57.75,10.24 arc45 v58.1,9.4 | LED0.2-DOUT 61.25,8 arc45 v61,8.6
  Bottom 0.152: v61,8.6 60.9,8.7 59.79,8.7 arc-45 v58.1,9.4
N$2
  Bottom 0.152: R15.2 25.74,18.2 arc-45 25.5,18.3 25.34,18.46 arc45 25,18.6 22.47,18.6 arc45 21.5,18.2 21.24,17.94 arc-45 19.7,17.3 17.08,17.3 arc45 16.6,17.1 16.54,17.04 arc-45 14.75,16.3 11.75,16.3 arc-45 9.96,17.04 9.9,17.1 arc-45 9.64,17.73 I2S0(DAP4)1.2
N$3
  Bottom 0.152: I2S0(DAP4)1.4 8.29,20.91 arc45 7.3,20.5 arc45 6.9,19.53 6.9,18.8 arc45 7.11,18.29 9.03,16.37 arc45 10.65,15.7 15.91,15.7 arc45 17.6,16.4 arc-45 18.32,16.7 19.72,16.7 arc-45 20.2,16.5 arc45 20.44,16.4 20.6,16.4 arc45 21.11,16.61 21.58,17.08 arc-45 R19.2
N$4  (via drill 0.35)
  Top 0.152: v17.8,20.2 17.55,20.2 arc-45 v15.76,19.46
  Bottom 0.152: R20.2 27.5,20.95 arc45 26.9,21.2 26.68,21.2 arc45 26.2,21 25.44,20.24 arc-45 24.64,19.91 arc-45 23.7,20.3 22.77,21.23 arc-45 22.7,21.4 21.68,22.42 arc45 21,22.7 arc45 19.98,22.28 17.97,20.27 arc-45 v17.8,20.2 | v15.76,19.46 arc-45 15.22,19.68 13.53,21.37 arc45 I2S0(DAP4)1.5
N$5
  Top 0.152: R21.1 20,50.9 LED5.ANODE
N$6  (via drill 0.35)
  Top 0.152: 53.3,7.4 LED1.2-DOUT arc-45 51.92,6.8 v51.5,6.8 | v49.9,9.3 49.9,10.29 arc45 LED2.4-DIN
  Bottom 0.152: v51.5,6.8 50.54,7.76 arc-45 v49.9,9.3
N$7
  Top 0.152: IC2.4:LED1 20.5,29.4 R7.1
N$8  (via drill 0.35)
  Top 0.152: LED2.2-DOUT 45.25,8.45 v45.1,8.6 | LED3.4-DIN 42,10.4 v42,9.4
  Bottom 0.152: v45.1,8.6 43.93,8.6 arc-45 v42,9.4
N$9  (via drill 0.35)
  Top 0.152: LED4.4-DIN 33.8,10.6 v33.8,9.4 | LED3.2-DOUT 37.25,7.86 arc45 v36.9,8.7
  Bottom 0.152: v36.9,8.7 arc45 36.42,8.9 34.5,8.9 arc-45 34.16,9.04 v33.8,9.4
N$10
  Top 0.152: IC2.3:LED0 21.15,30.15 20.2,31.1 R7.2
N$12
  Top 0.152: R7.7 17.5,31.1 17,31.6 17,40.5 16.04,41.46 U$10.1:SIGNAL3
N$13
  Top 0.152: U$16.1:SIGNAL3 13.84,30.3 R7.8
N$28
  Top 0.152: R4.1 R24.2 33.4,76.25 33.4,77 35.02,78.62 U2.10
OUTN
  Top 0.152: U$13.10 24.45,48.35 19.1,53.7 19.1,62.8 19.3,63 L2.1
  pour Top (no thermals): 24.5,46.3 24.4,46.3 24.4,47.7 17.1,55 17.1,63.8 17.7,64.4 23.3,64.4 23.7,64 23.7,62.3 20.1,58.7 20.1,53.3 24.5,48.9
OUTP
  Top 0.152: U$13.9 24.95,49.95 21.5,53.4 21.5,58.3 26.2,63 L1.1
  pour Top (no thermals): 24.9,46.4 24.9,49 20.5,53.4 20.5,58.6 26,64.1 34.2,64.1 34.8,63.5 34.8,61.4 34.3,60.9 25,60.9 22.7,58.6 22.7,52.7 25.4,50 25.4,46.7 25.1,46.4
SP_M
  Top 0.152: L2.2 17.6,70.1 C9.2 17.6,78.33 L4.1
  pour Top (no thermals): 16.2,69.8 16.2,78.1 17,78.9 18.5,78.9 18.8,78.6 19.7,77.7 19.7,69.5 20.9,68.3 22.2,68.3 22.9,68.3 23.1,68.1 23.3,67.9 23.3,66.2 23.1,66 17.9,66 16.2,67.7
SP_MINUS
  Top 0.152: L4.2 17.8,80.6 16.8,81.6 | 8.3,82.7 15.7,82.7 16.8,81.6 | 8.3,82.7 5.9,85.1 T4.P$1 T4.P$2 | U$12.1 16.2,81 16.8,81.6 | 8.3,82.7 3.2,82.7 CN5.1
  pour Top (no thermals): 1.5,94.6 4.3,97.4 7.2,97.4 8.1,96.5 8.1,86.2 10.4,83.9 15.4,83.9 18.8,80.5 18.8,79.7 18.4,79.3 17,79.3 15.4,80.9 15.4,81.4 15.3,81.5 2.1,81.5 1.5,82.1
  pour Bottom (no thermals): 3.4,86 3.4,96.5 4.4,97.5 7.2,97.5 8,96.7 8,86.2 7.2,85.4 4,85.4
SP_P
  Top 0.152: L3.1 21.1,76.3 23.6,73.8 29.8,73.8 33.1,70.5 C21.2 31.2,68.4 L1.2
  pour Top (no thermals): 20.1,78.5 20.4,78.8 21.9,78.8 23.3,77.4 23.3,76.4 24.8,74.9 29.5,74.9 32.5,71.9 33.8,71.9 34.7,71 34.7,70.9 34.7,66.6 33.7,65.6 28.6,65.6 28.3,65.9 28.3,67.8 28.4,67.9 29,68.5 30,68.5 30.3,68.8 30.3,71 28.8,72.5 27.5,72.5 22.4,72.5 20.3,74.6 20.1,74.8
SP_PLUS
  Top 0.152: 17.4,85.4 13.4,85.4 11.11,87.69 T3.P$1 T3.P$2 | 17.4,85.4 17.45,85.35 21.1,81.7 L3.2 22.4,79.78 U$11.1 | 17.4,85.4 16,86.8 CN4.1
  pour Top (no thermals): 20.5,79.4 15.6,84.3 10.7,84.3 8.9,86.1 8.9,96.5 9.9,97.5 12.2,97.5 13.1,96.6 13.1,92.6 22.6,83.1 22.6,79.6 22.4,79.4
  pour Bottom (no thermals): 8.9,96.6 9.8,97.5 12.2,97.5 13.2,96.5 13.2,86.2 12.4,85.4 9.8,85.4 8.9,86.3
WS  (via drill 0.35)
  Top 0.152: v33.9,14 34.1,13.8 66.16,13.8 arc-45 66.4,13.7 66.82,13.28 arc45 67.5,12.99 76,12.99 arc-90 76.9,12.1 v76.9,7.6 | v11.8,13 arc45 11.87,12.83 13.3,11.4 arc45 14.27,11 14.3,11 arc45 14.81,11.21 14.9,11.3 arc45 15,11.54 15,12.53 arc-45 15.4,13.5 15.45,13.55 arc-45 16.3,13.9 17.43,13.9 arc-45 18.4,13.5 18.59,13.31 arc45 19.1,13.1 19.19,13.1 arc45 20.4,13.6 arc-45 21.12,13.9 21.3,13.9 arc-45 21.81,13.69 22.46,13.04 arc45 22.8,12.9 arc45 23.65,13.25 23.9,13.5 arc-45 24.62,13.8 26.88,13.8 arc-45 27.6,13.5 arc45 28.32,13.2 28.92,13.2 arc45 29.4,13.4 arc45 29.6,13.88 29.6,14.2 arc45 29.32,14.88 29.2,15 arc-45 28.9,15.72 28.9,15.9 29.06,16.06 arc-45 29.4,16.2 29.66,16.2 arc-45 29.9,16.1 v30.4,15.6
  Bottom 0.152: 32.25,15.65 C20.2 arc-45 32.2,15.82 R11.2 | MIC_LEFT1.5 arc90 74.25,7 76.3,7 arc90 v76.9,7.6 | v33.9,14 arc-45 32.88,14.42 32.67,14.63 arc-45 32.25,15.65 | MIC_RIGHT1.5 2.73,7.23 arc45 3.47,5.43 3.8,5.1 arc45 4.52,4.8 4.7,4.8 | 4.7,4.8 4.92,4.8 | 9.48,13.88 arc45 9.2,13.2 arc45 9.48,12.52 10.6,11.4 arc-45 10.9,10.68 10.9,10.1 arc-45 10.55,9.25 10.4,9.1 arc-45 9.92,8.9 9.4,8.9 arc-45 8.72,9.18 7.95,9.95 arc45 7.1,10.3 6.98,10.3 arc45 6.11,9.94 arc45 5.88,9.39 arc45 6.35,8.25 6.4,8.2 arc-45 6.7,7.48 6.7,6.38 arc-45 6.5,5.9 5.89,5.29 arc-45 4.7,4.8 | 9.5,13.9 9.48,13.88 | 9.48,13.88 arc-45 10.01,14.1 10.3,14.1 arc-45 10.98,13.82 v11.8,13 | v30.4,15.6 30.59,15.41 arc45 31.1,15.2 31.16,15.2 arc45 32.25,15.65
WS_98
  Top 0.152: 22.58,45.5 arc-45 U$13.14 arc45 22.58,45.5 | 22.58,45.5 21.11,45.5 arc45 19.26,44.74 arc45 18.83,43.69 arc45 19.2,42.8 arc-45 19.6,41.83 R9.2 18.25,40.9 C13.2

### Text on the board
Document: SP | GPIO6 | I 2C | SG-90 | I 2S Input | #529 Agent Kit For Orin Nano Rev1.3 / 2023/04/12